# EAGLE schematic 63-00013_Battery_PCB_6.3 (EAGLE 9.6.2), part 1 of 2
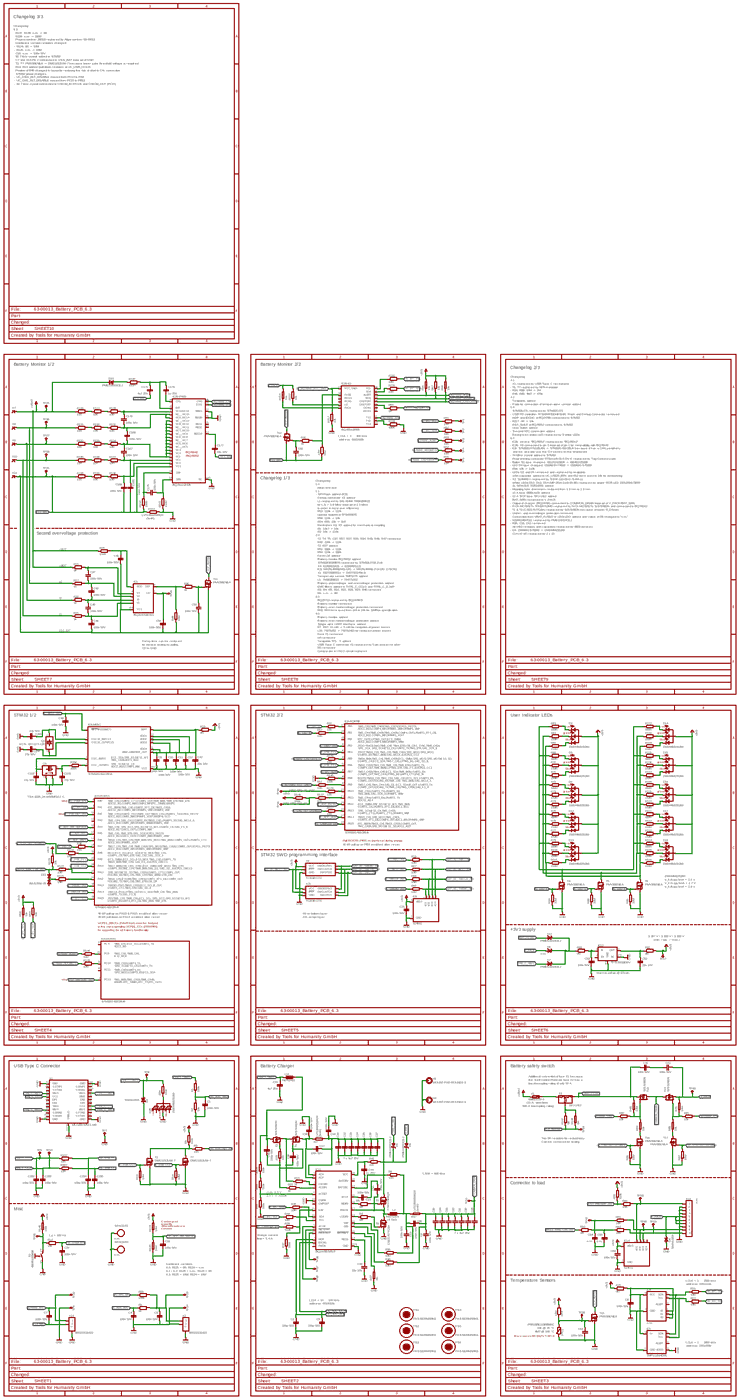
[diagram p0: schematic, sheet 1, overview]
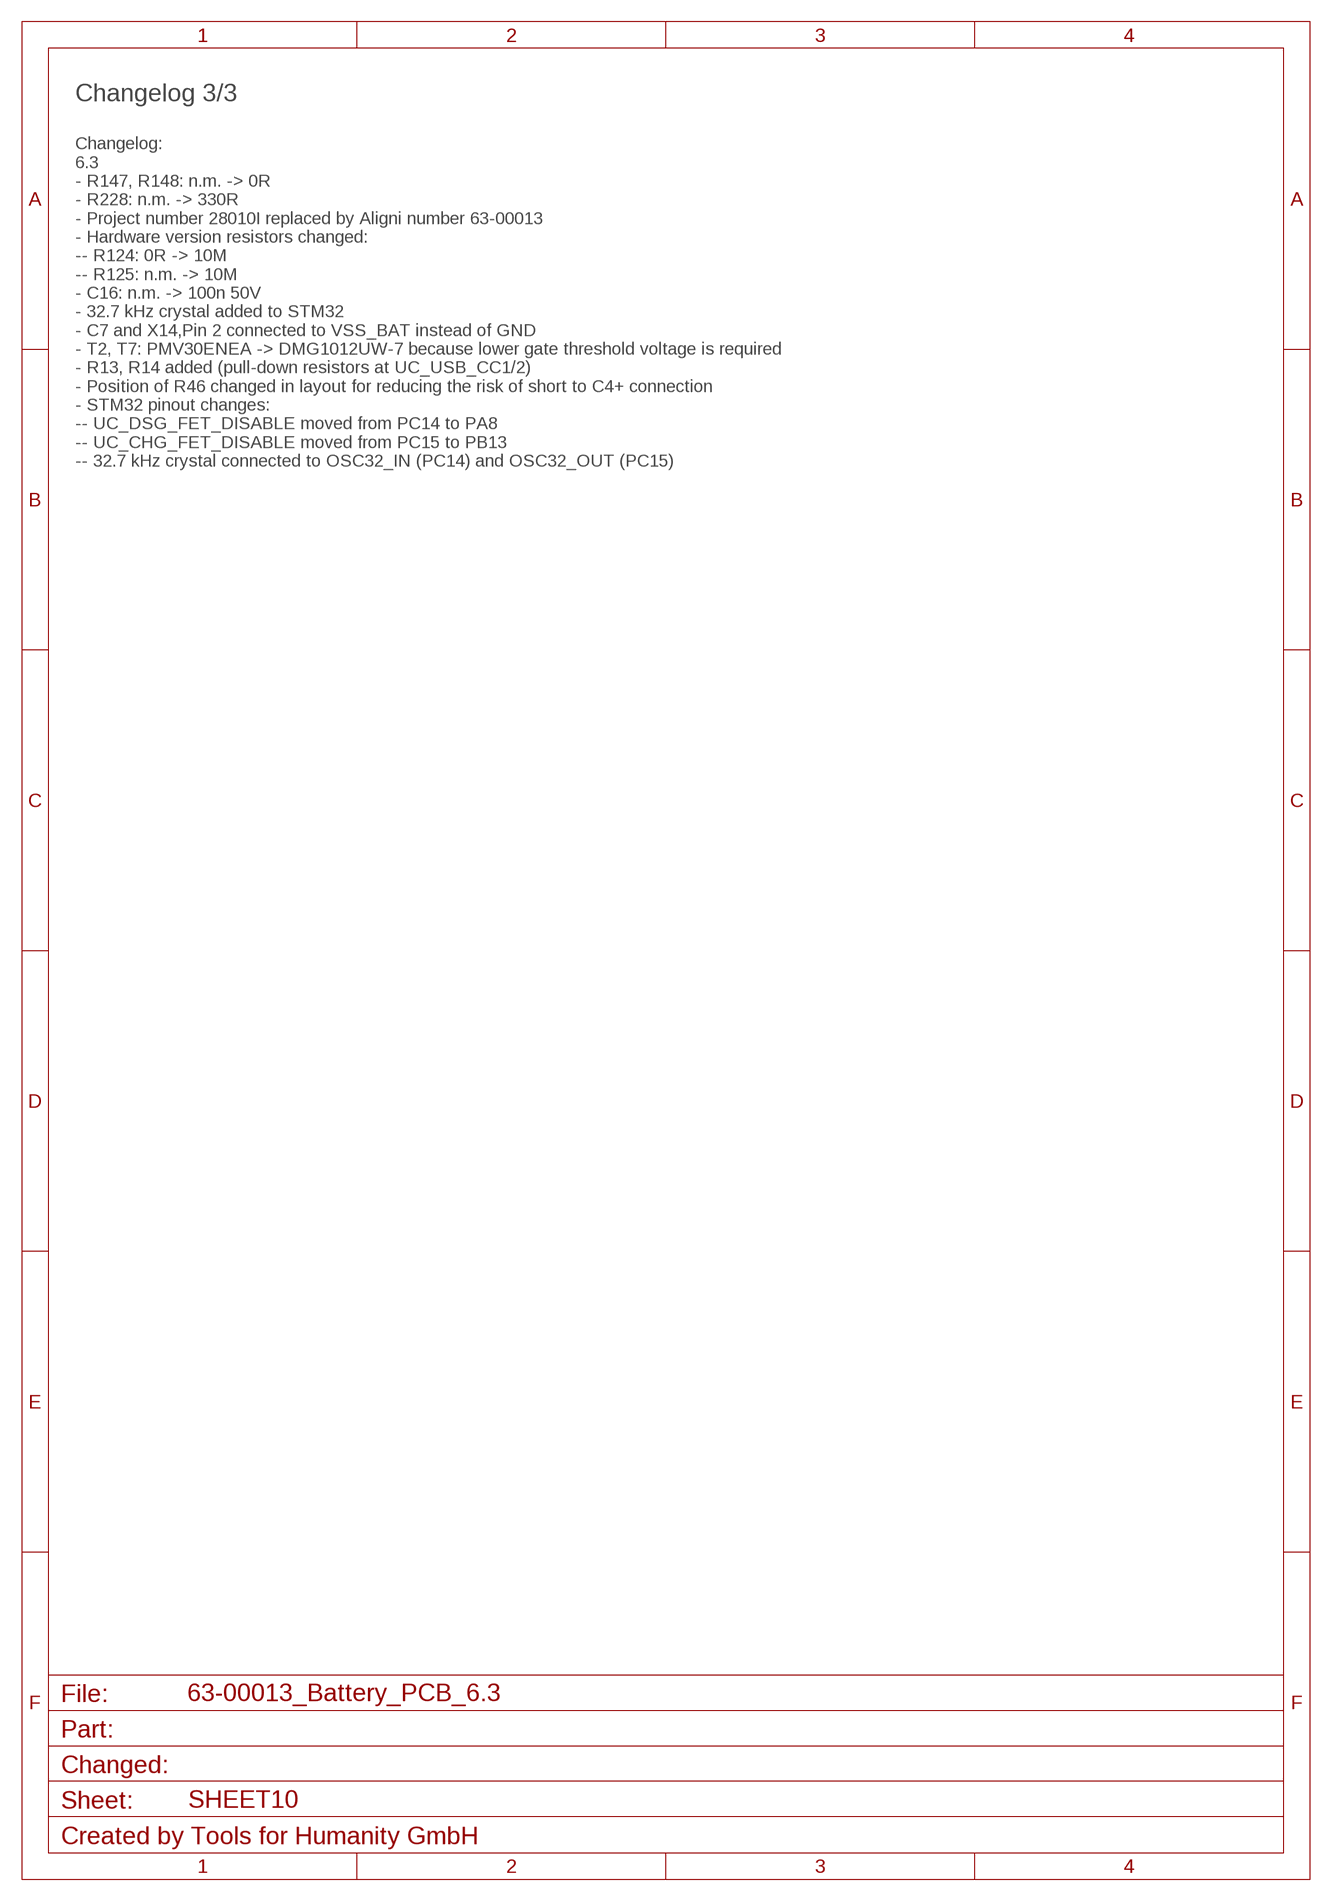
[diagram p1: schematic, sheet 1, part 1 of 7]
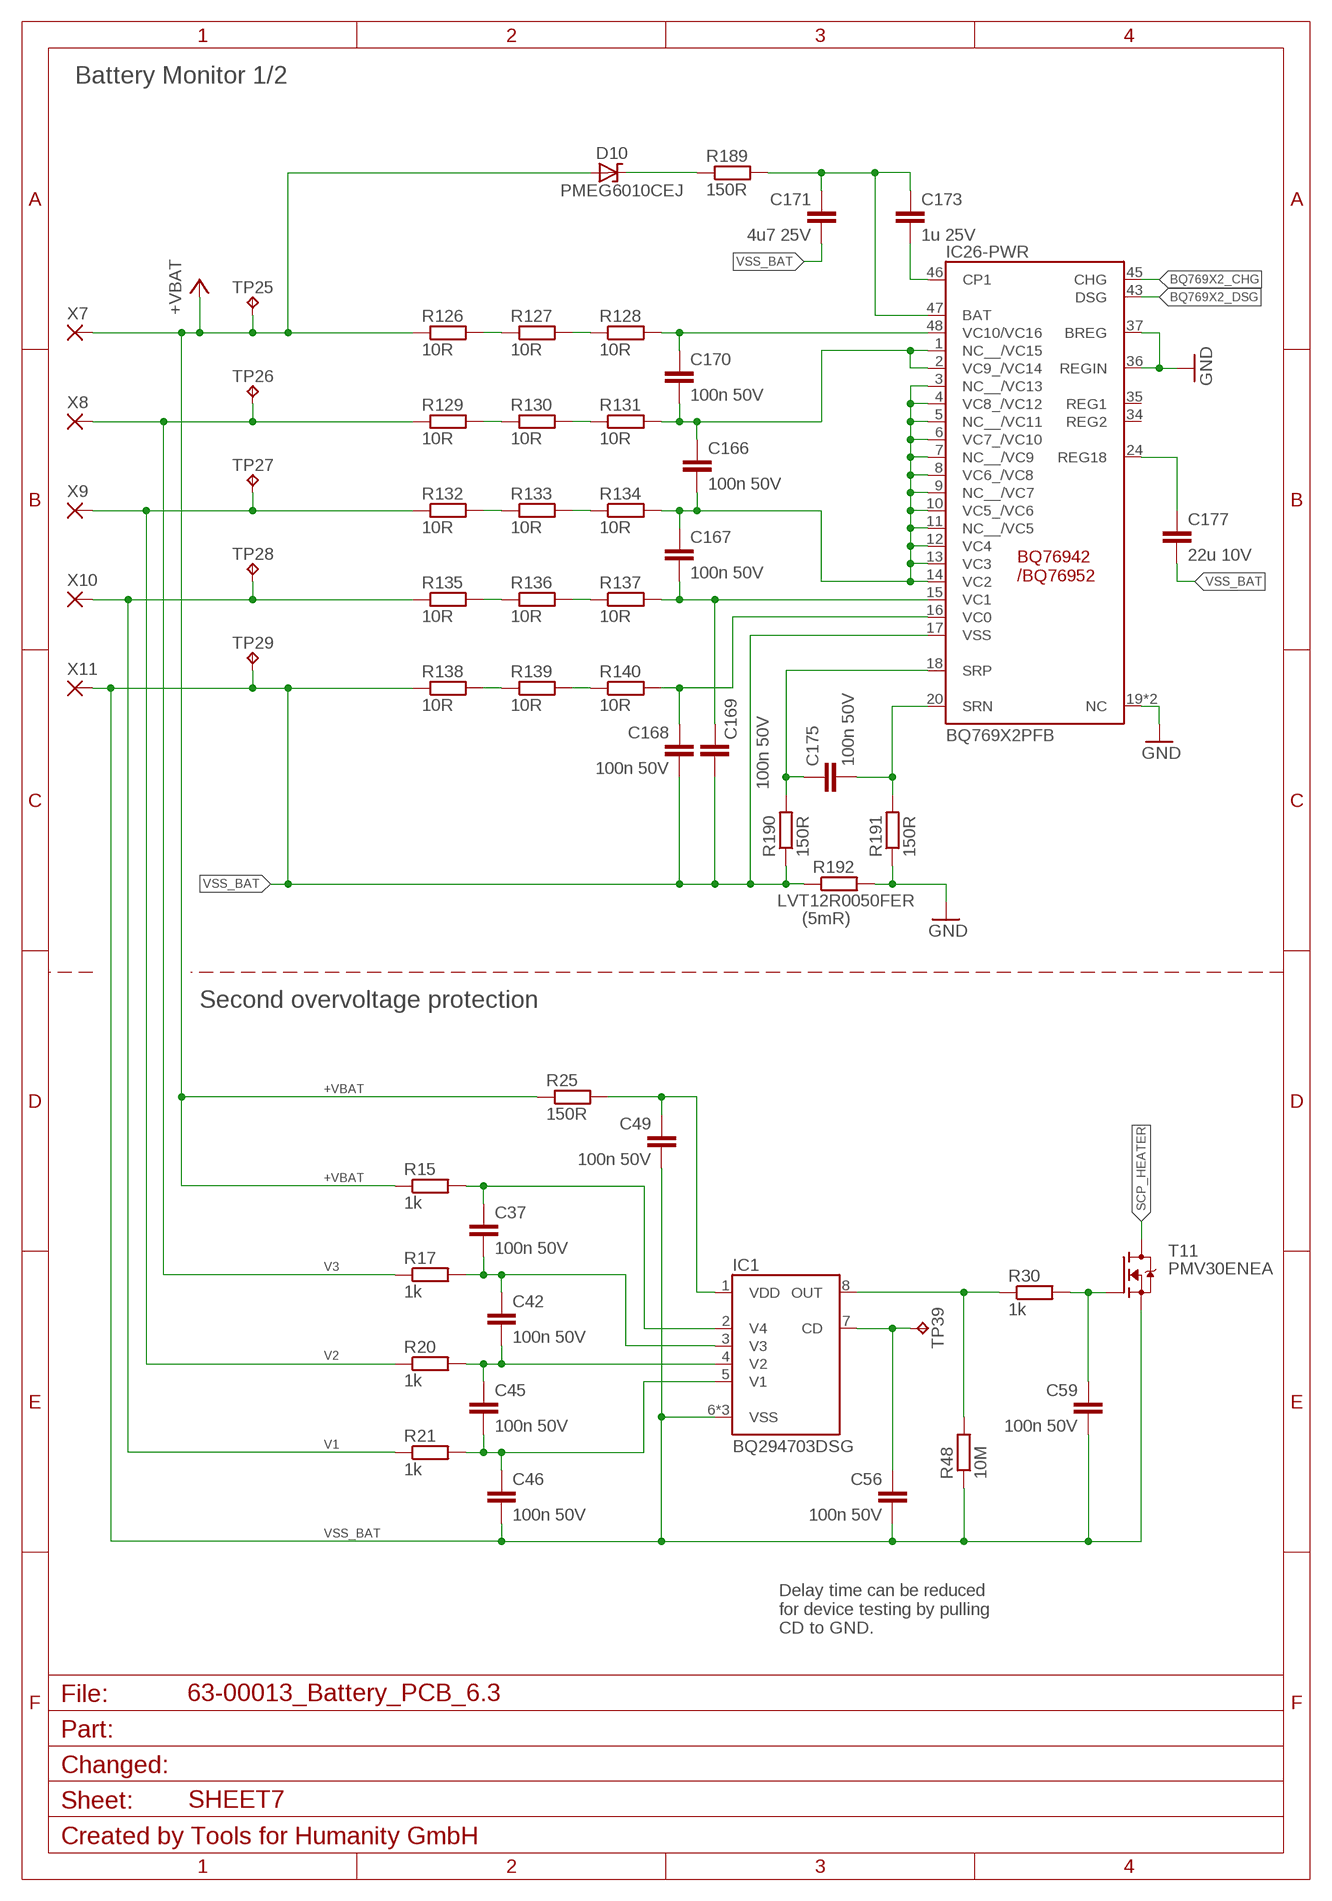
[diagram p2: schematic, sheet 1, part 2 of 7]
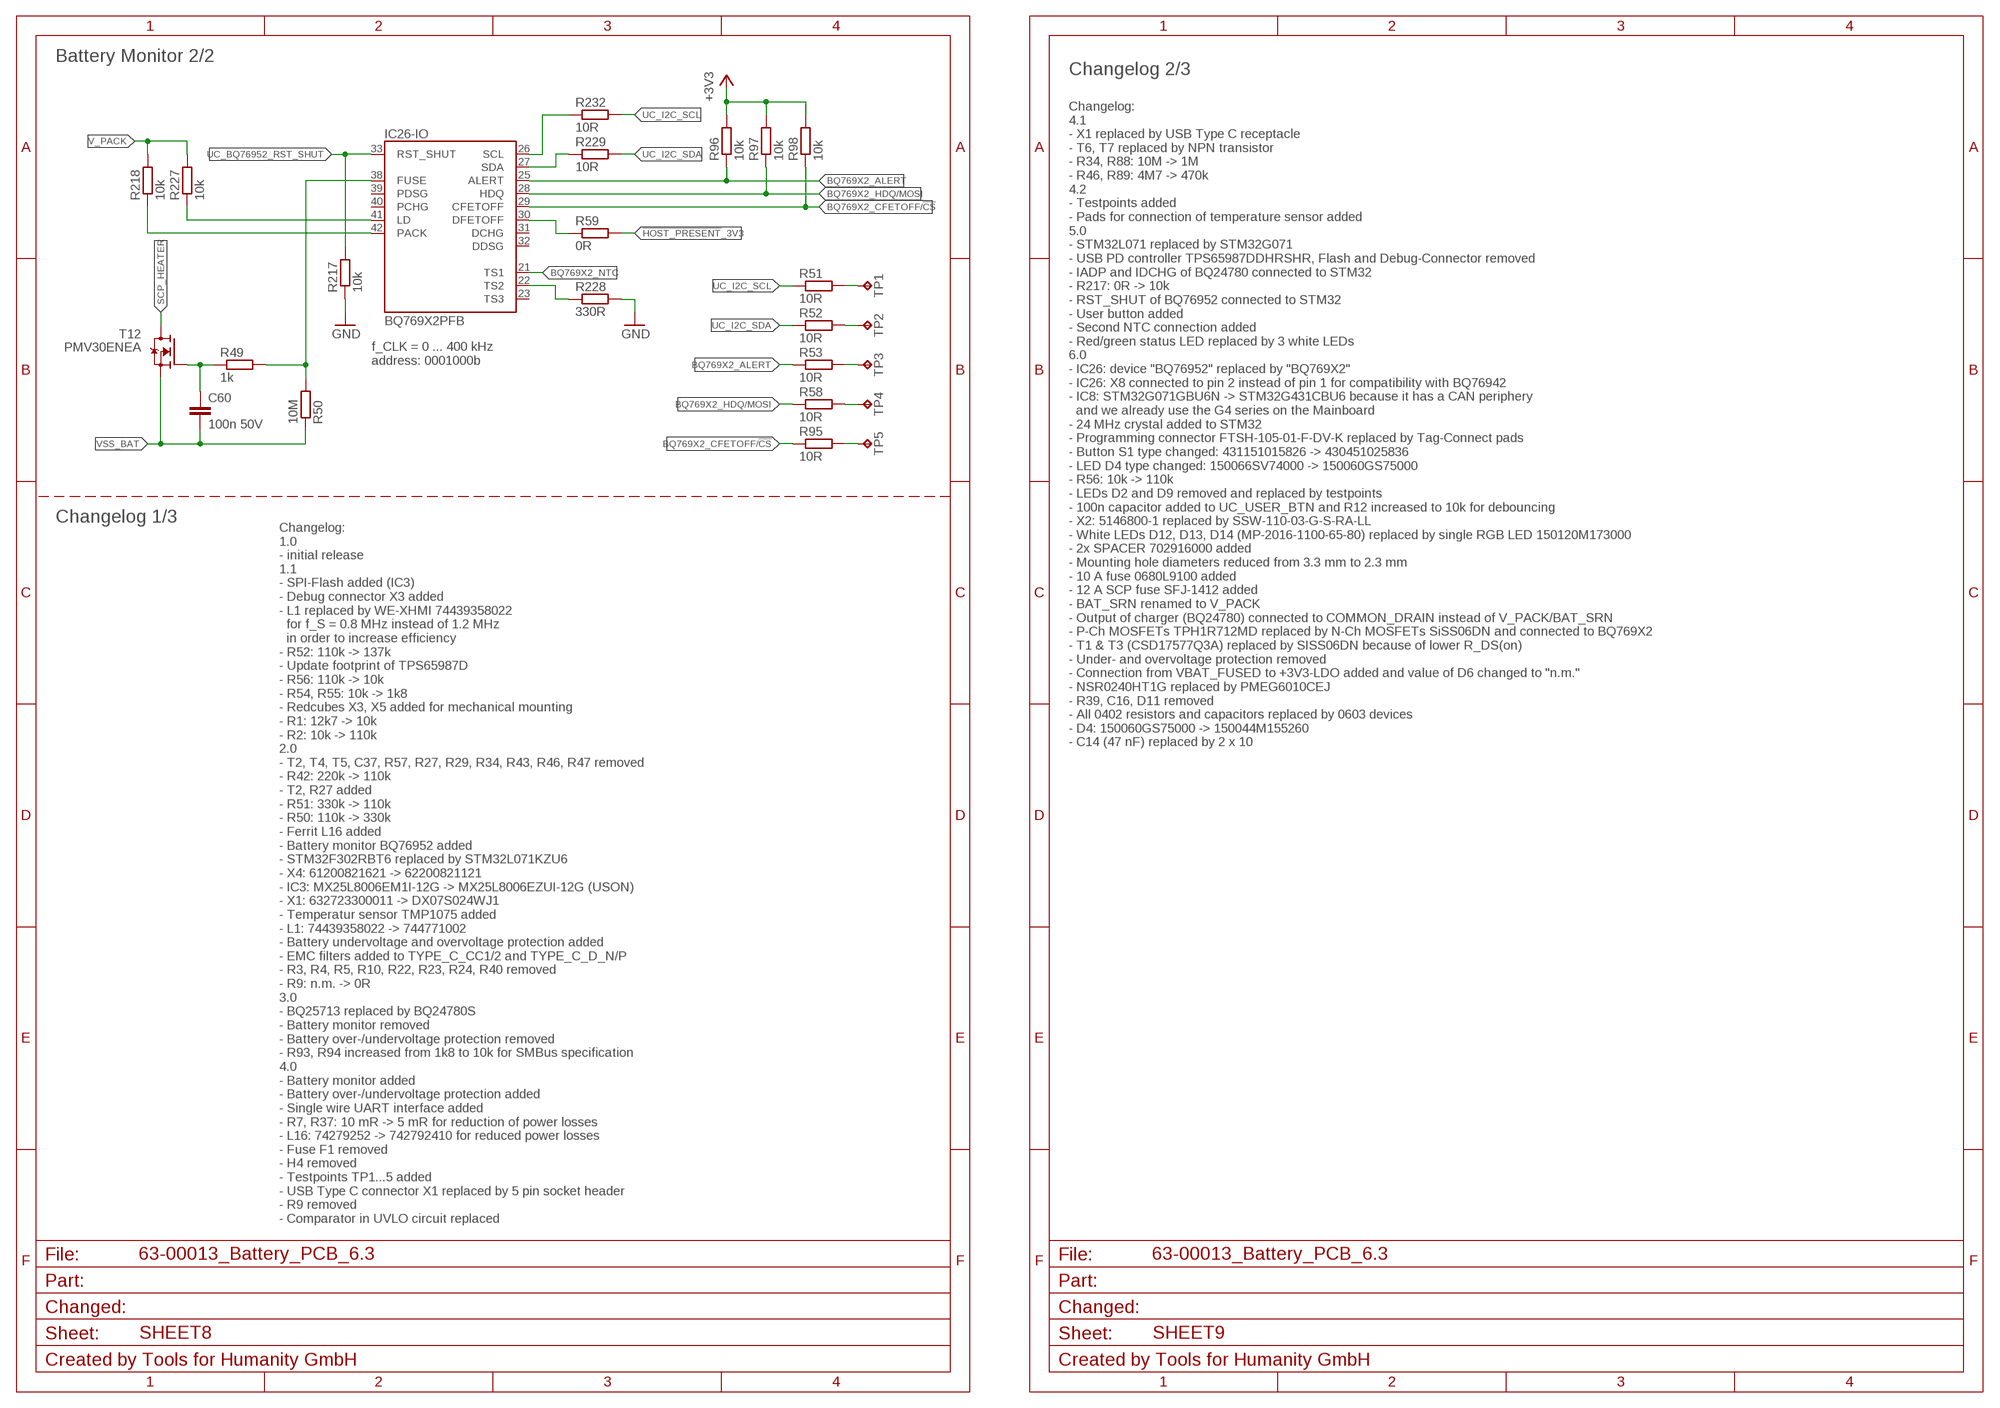
[diagram p3: schematic, sheet 1, part 3 of 7]
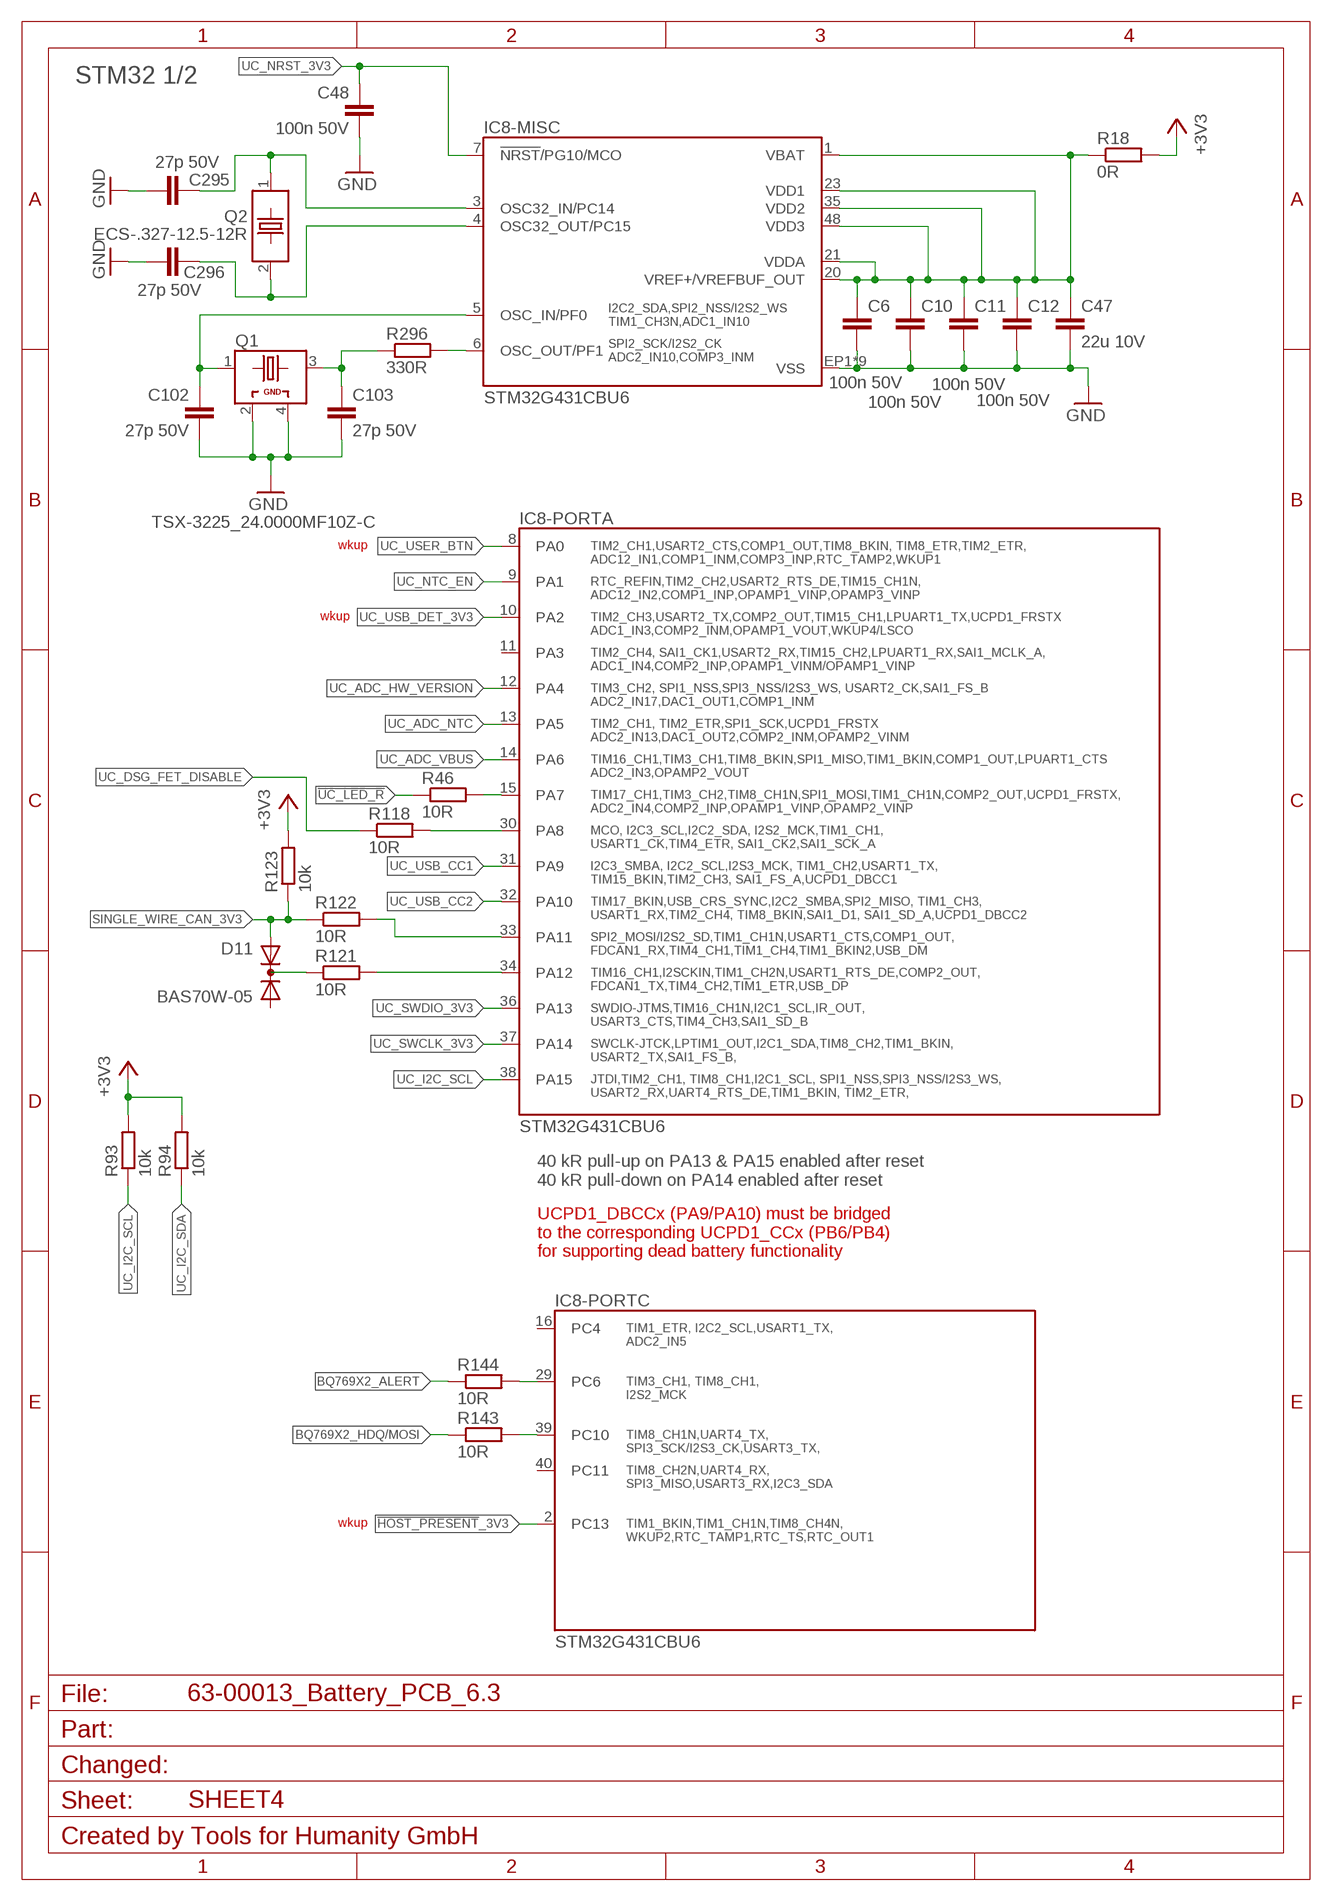
[diagram p4: schematic, sheet 1, part 4 of 7]
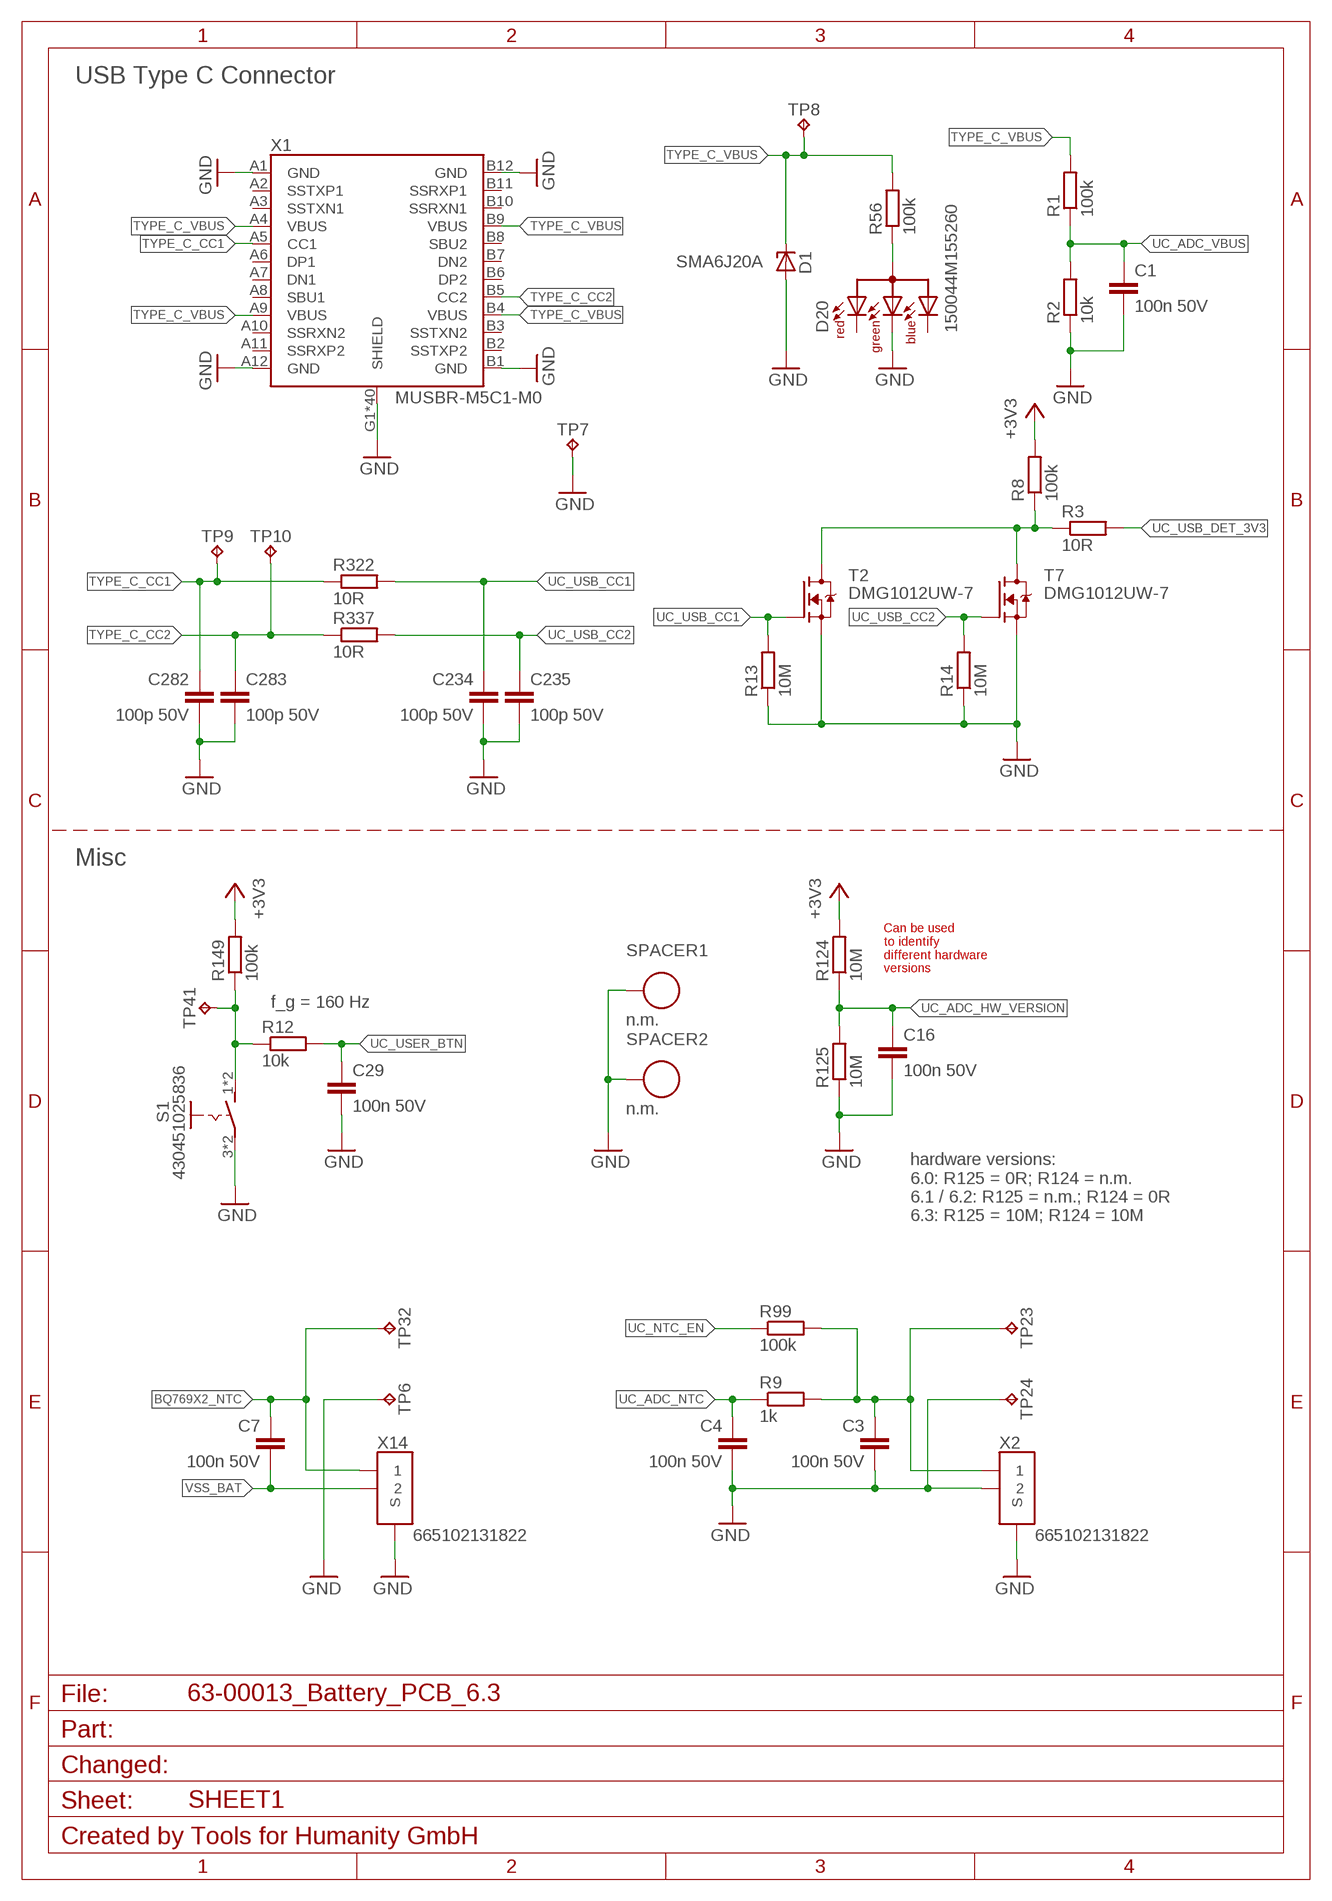
[diagram p5: schematic, sheet 1, part 5 of 7]
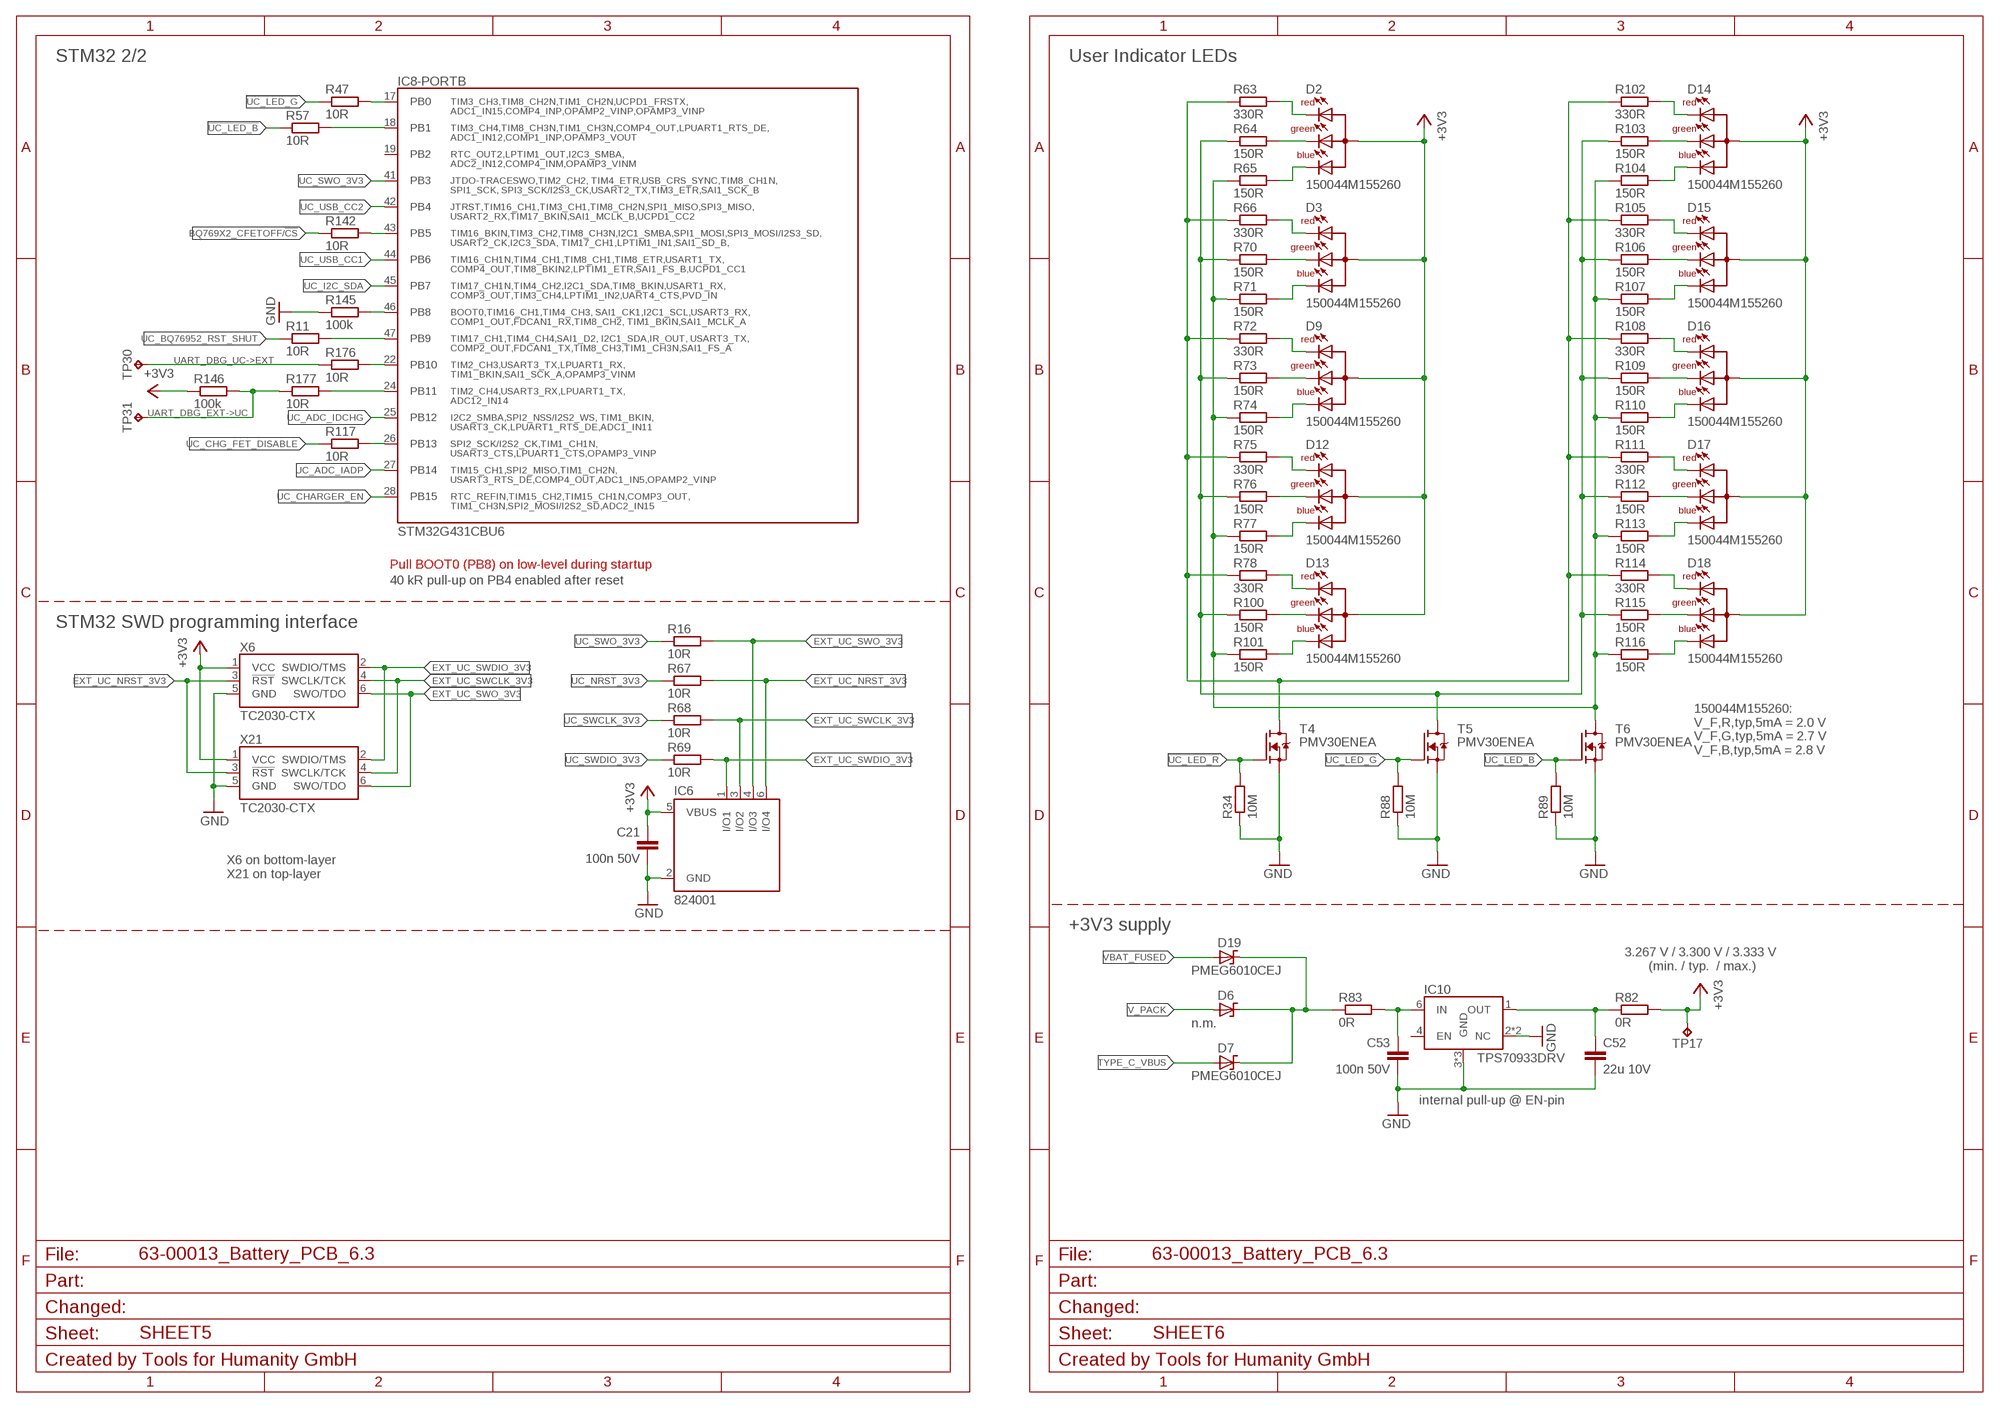
[diagram p6: schematic, sheet 1, part 6 of 7]
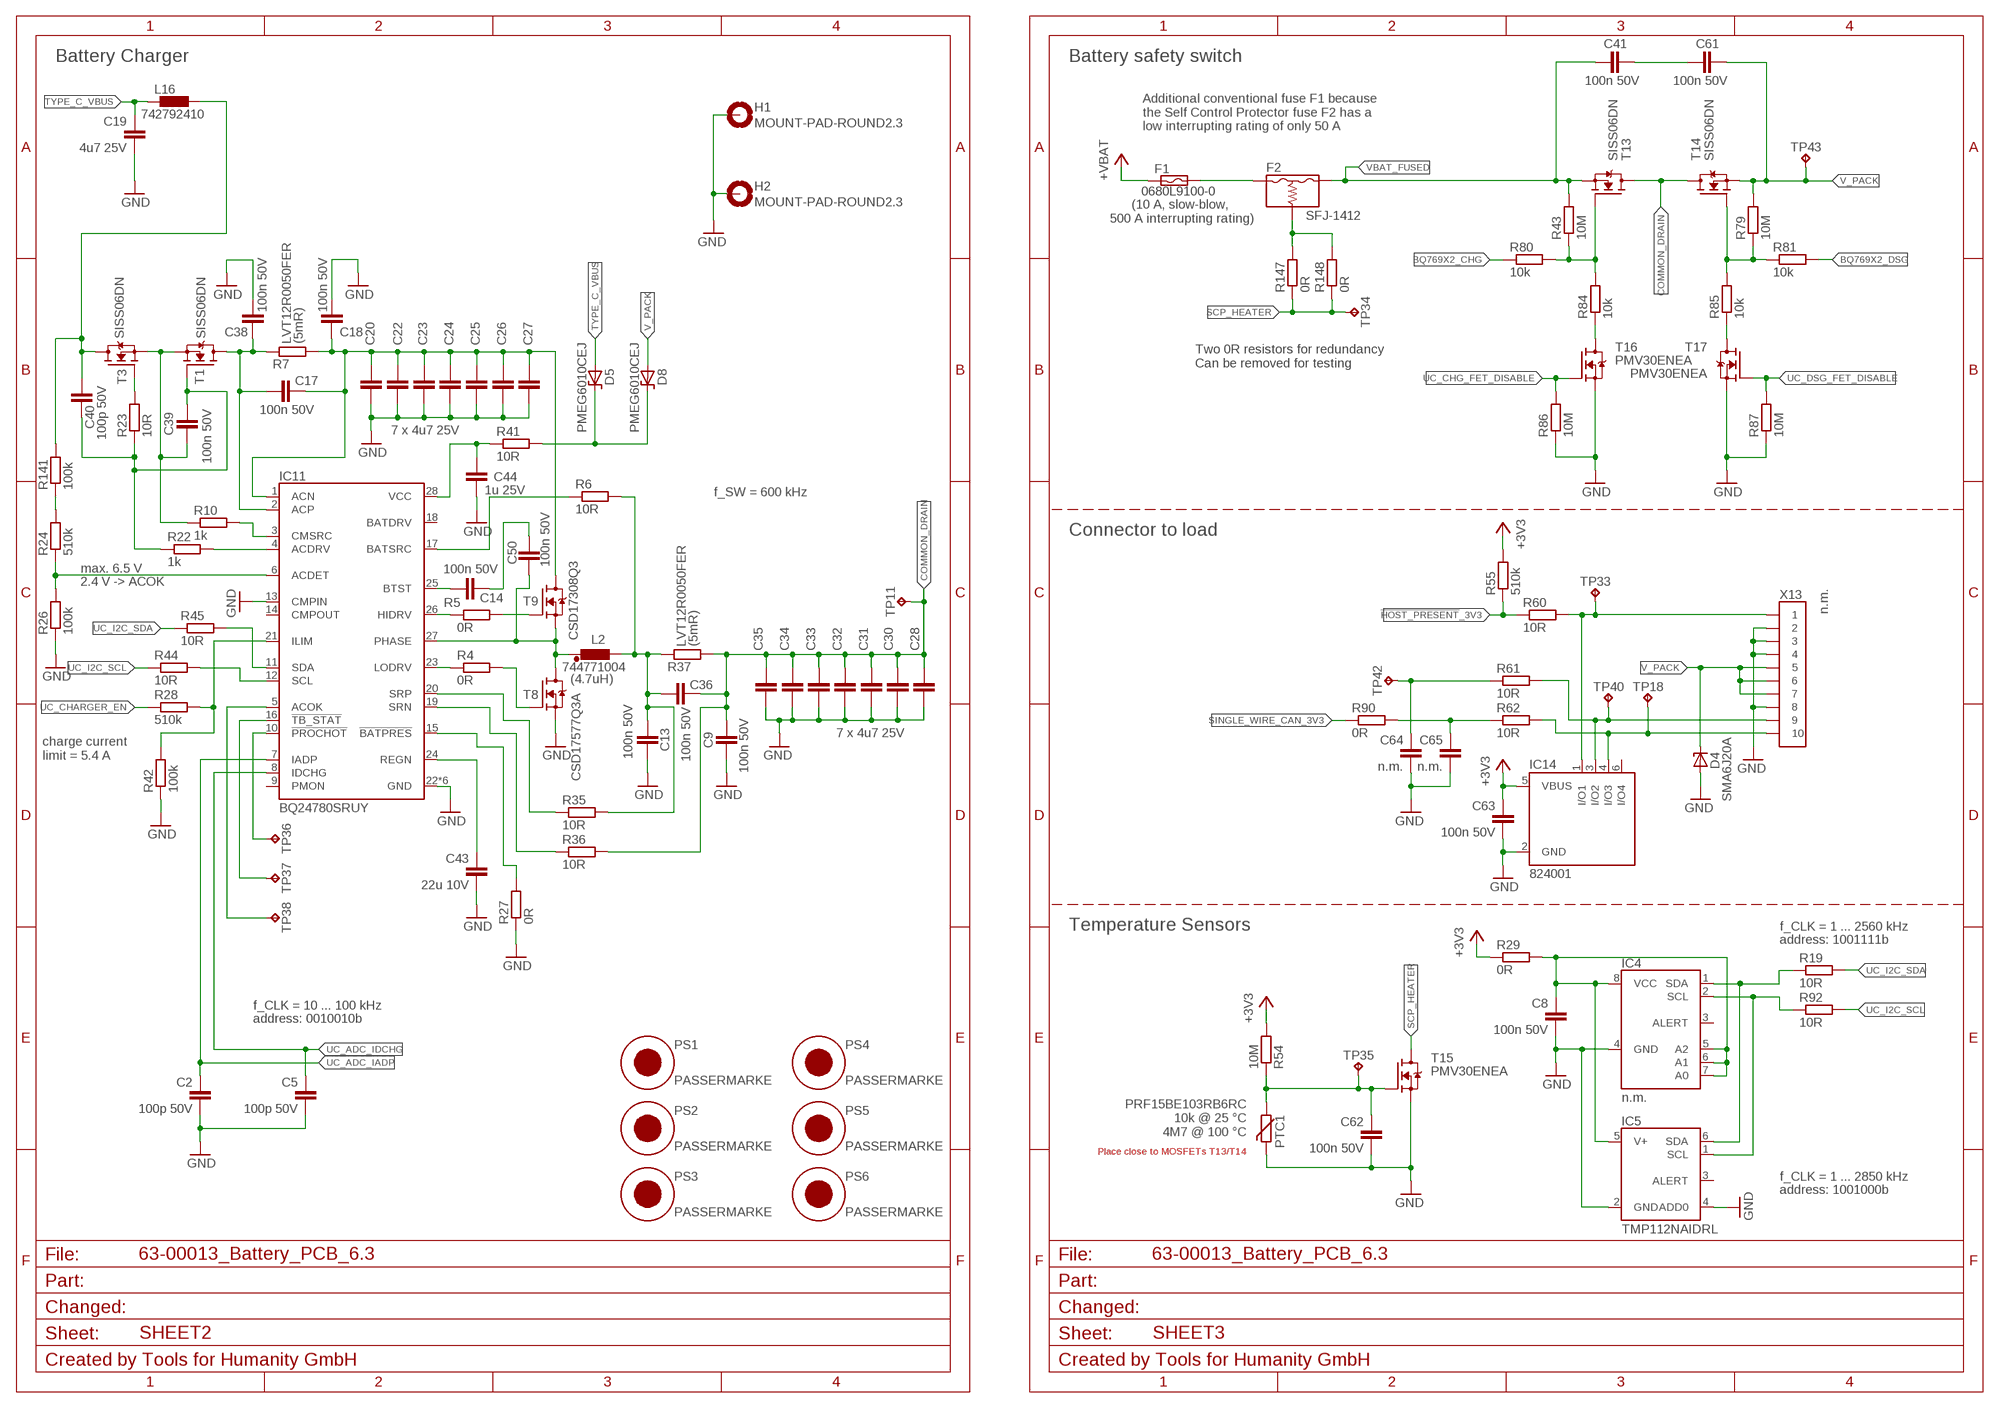
[diagram p7: schematic, sheet 1, part 7 of 7]

## Parts
C1  100n 50V  C-EU-100N-C0603  [C0603]
C2  100p 50V  C-EU-100P-C0603  [C0603]
C3  100n 50V  C-EU-100N-C0603  [C0603]
C4  100n 50V  C-EU-100N-C0603  [C0603]
C5  100p 50V  C-EU-100P-C0603  [C0603]
C6  100n 50V  C-EU-100N-C0603  [C0603]
C7  100n 50V  C-EU-100N-C0603  [C0603]
C8  100n 50V  C-EU-100N-C0603  [C0603]
C9  100n 50V  C-EU-100N-C0603  [C0603]
C10  100n 50V  C-EU-100N-C0603  [C0603]
C11  100n 50V  C-EU-100N-C0603  [C0603]
C12  100n 50V  C-EU-100N-C0603  [C0603]
C13  100n 50V  C-EU-100N-C0603  [C0603]
C14  100n 50V  C-EU-100N-C0603  [C0603]
C16  100n 50V  C-EU-100N-C0603  [C0603]
C17  100n 50V  C-EU-100N-C0603  [C0603]
C18  100n 50V  C-EU-100N-C0603  [C0603]
C19  4u7 25V  C-EU-4U7-25V-C1210  [C1210]
C20  4u7 25V  C-EU-4U7-25V-C1210  [C1210]
C21  100n 50V  C-EU-100N-C0603  [C0603]
C22  4u7 25V  C-EU-4U7-25V-C1210  [C1210]
C23  4u7 25V  C-EU-4U7-25V-C1210  [C1210]
C24  4u7 25V  C-EU-4U7-25V-C1210  [C1210]
C25  4u7 25V  C-EU-4U7-25V-C1210  [C1210]
C26  4u7 25V  C-EU-4U7-25V-C1210  [C1210]
C27  4u7 25V  C-EU-4U7-25V-C1210  [C1210]
C28  4u7 25V  C-EU-4U7-25V-C1210  [C1210]
C29  100n 50V  C-EU-100N-C0603  [C0603]
C30  4u7 25V  C-EU-4U7-25V-C1210  [C1210]
C31  4u7 25V  C-EU-4U7-25V-C1210  [C1210]
C32  4u7 25V  C-EU-4U7-25V-C1210  [C1210]
C33  4u7 25V  C-EU-4U7-25V-C1210  [C1210]
C34  4u7 25V  C-EU-4U7-25V-C1210  [C1210]
C35  4u7 25V  C-EU-4U7-25V-C1210  [C1210]
C36  100n 50V  C-EU-100N-C0603  [C0603]
C37  100n 50V  C-EU-100N-C0603  [C0603]
C38  100n 50V  C-EU-100N-C0603  [C0603]
C39  100n 50V  C-EU-100N-C0603  [C0603]
C40  100p 50V  C-EU-100P-C0603  [C0603]
C41  100n 50V  C-EU-100N-C0603  [C0603]
C42  100n 50V  C-EU-100N-C0603  [C0603]
C43  22u 10V  C-EU-22U-C0805  [C0805]
C44  1u 25V  C-EU-1U-C0805  [C0805]
C45  100n 50V  C-EU-100N-C0603  [C0603]
C46  100n 50V  C-EU-100N-C0603  [C0603]
C47  22u 10V  C-EU-22U-C0805  [C0805]
C48  100n 50V  C-EU-100N-C0603  [C0603]
C49  100n 50V  C-EU-100N-C0603  [C0603]
C50  100n 50V  C-EU-100N-C0603  [C0603]
C52  22u 10V  C-EU-22U-C0805  [C0805]
C53  100n 50V  C-EU-100N-C0603  [C0603]
C56  100n 50V  C-EU-100N-C0603  [C0603]
C59  100n 50V  C-EU-100N-C0603  [C0603]
C60  100n 50V  C-EU-100N-C0603  [C0603]
C61  100n 50V  C-EU-100N-C0603  [C0603]
C62  100n 50V  C-EU-100N-C0603  [C0603]
C63  100n 50V  C-EU-100N-C0603  [C0603]
C64  n.m.  C-EU-C0603  [C0603]
C65  n.m.  C-EU-C0603  [C0603]
C102  27p 50V  C-EU-27P-C0603  [C0603]
C103  27p 50V  C-EU-27P-C0603  [C0603]
C166  100n 50V  C-EU-100N-C0603  [C0603]
C167  100n 50V  C-EU-100N-C0603  [C0603]
C168  100n 50V  C-EU-100N-C0603  [C0603]
C169  100n 50V  C-EU-100N-C0603  [C0603]
C170  100n 50V  C-EU-100N-C0603  [C0603]
C171  4u7 25V  C-EU-4U7-25V-C1210  [C1210]
C173  1u 25V  C-EU-1U-C0805  [C0805]
C175  100n 50V  C-EU-100N-C0603  [C0603]
C177  22u 10V  C-EU-22U-C0805  [C0805]
C234  100p 50V  C-EU-100P-C0603  [C0603]
C235  100p 50V  C-EU-100P-C0603  [C0603]
C282  100p 50V  C-EU-100P-C0603  [C0603]
C283  100p 50V  C-EU-100P-C0603  [C0603]
C295  27p 50V  C-EU-27P-C0603  [C0603]
C296  27p 50V  C-EU-27P-C0603  [C0603]
D1  SMA6J20A  [SMA_ST]
D2  150044M155260  [150044M155260_WUERTH]
D3  150044M155260  [150044M155260_WUERTH]
D4  SMA6J20A  [SMA_ST]
D5  PMEG6010CEJ  [SOD323F_SC-90_NXP]
D6  n.m.  PMEG6010CEJ  [SOD323F_SC-90_NXP]
D7  PMEG6010CEJ  [SOD323F_SC-90_NXP]
D8  PMEG6010CEJ  [SOD323F_SC-90_NXP]
D9  150044M155260  [150044M155260_WUERTH]
D10  PMEG6010CEJ  [SOD323F_SC-90_NXP]
D11  BAS70W-05  [SOT-323_DIODES_INC]
D12  150044M155260  [150044M155260_WUERTH]
D13  150044M155260  [150044M155260_WUERTH]
D14  150044M155260  [150044M155260_WUERTH]
D15  150044M155260  [150044M155260_WUERTH]
D16  150044M155260  [150044M155260_WUERTH]
D17  150044M155260  [150044M155260_WUERTH]
D18  150044M155260  [150044M155260_WUERTH]
D19  PMEG6010CEJ  [SOD323F_SC-90_NXP]
D20  150044M155260  [150044M155260_WUERTH]
F1  0680L9100-0  [0680L_BEL_FUSE]
F2  SFJ-1412  [SFJ-XX12_DEXERIALS]
H1  MOUNT-PAD-ROUND2.3  [2,3-PAD]
H2  MOUNT-PAD-ROUND2.3  [2,3-PAD]
IC1  BQ294703DSG  [DSG0008A_WSON_TI]
IC4  n.m.  TMP1075DGK  [S-PDSO-G8_DGK_VSSOP_TI]
IC5  TMP112NAIDRL  [DRL0006A_TI]
IC6  824001  [SOT23-6L_WE]
IC8  STM32G431CBU6  [UFQFPN48_ST]
IC10  TPS70933DRV  [DRV0006A_TI]
IC11  BQ24780SRUY  [RUY0028A_TI]
IC14  824001  [SOT23-6L_WE]
IC26  BQ769X2PFB  [S-PQFP-G48_PFB_TI]
L2  744771004  [WE-PD_1260_WE]
L16  742792410  [FERRIT_1806_WUERTH]
PS1  PASSERMARKE  [PASSERMARKE]
PS2  PASSERMARKE  [PASSERMARKE]
PS3  PASSERMARKE  [PASSERMARKE]
PS4  PASSERMARKE  [PASSERMARKE]
PS5  PASSERMARKE  [PASSERMARKE]
PS6  PASSERMARKE  [PASSERMARKE]
PTC1  PRF15BE103RB6RC  [R0402]
Q1  TSX-3225_24.0000MF10Z-C  [TSX-3225_SEIKO_EPSON]
Q2  ECS-.327-12.5-12R  [ECX-12R_ECS]
R1  100k  R-EU-100K-R0603  [R0603]
R2  10k  R-EU-10K-R0603  [R0603]
R3  10R  R-EU-10R-R0603  [R0603]
R4  0R  R-EU-0R-R0603  [R0603]
R5  0R  R-EU-0R-R0603  [R0603]
R6  10R  R-EU-10R-R0603  [R0603]
R7  LVT12R0050FER  [LVT12_R003_OHMITE]
R8  100k  R-EU-100K-R0603  [R0603]
R9  1k  R-EU-1K-R0603  [R0603]
R10  1k  R-EU-1K-R0603  [R0603]
R11  10R  R-EU-10R-R0603  [R0603]
R12  10k  R-EU-10K-R0603  [R0603]
R13  10M  R-EU-10M-R0603  [R0603]
R14  10M  R-EU-10M-R0603  [R0603]
R15  1k  R-EU-1K-R0603  [R0603]
R16  10R  R-EU-10R-R0603  [R0603]
R17  1k  R-EU-1K-R0603  [R0603]
R18  0R  R-EU-0R-R0603  [R0603]
R19  10R  R-EU-10R-R0603  [R0603]
R20  1k  R-EU-1K-R0603  [R0603]
R21  1k  R-EU-1K-R0603  [R0603]
R22  1k  R-EU-1K-R0603  [R0603]
R23  10R  R-EU-10R-R0603  [R0603]
R24  510k  R-EU-510K-R0603  [R0603]
R25  150R  R-EU-150R-R0603  [R0603]
R26  100k  R-EU-100K-R0603  [R0603]
R27  0R  R-EU-0R-R0603  [R0603]
R28  510k  R-EU-510K-R0603  [R0603]
R29  0R  R-EU-0R-R0603  [R0603]
R30  1k  R-EU-1K-R0603  [R0603]
R34  10M  R-EU-10M-R0603  [R0603]
R35  10R  R-EU-10R-R0603  [R0603]
R36  10R  R-EU-10R-R0603  [R0603]
R37  LVT12R0050FER  [LVT12_R003_OHMITE]
R41  10R  R-EU-10R-R0603  [R0603]
R42  100k  R-EU-100K-R0603  [R0603]
R43  10M  R-EU-10M-R0603  [R0603]
R44  10R  R-EU-10R-R0603  [R0603]
R45  10R  R-EU-10R-R0603  [R0603]
R46  10R  R-EU-10R-R0603  [R0603]
R47  10R  R-EU-10R-R0603  [R0603]
R48  10M  R-EU-10M-R0603  [R0603]
R49  1k  R-EU-1K-R0603  [R0603]
R50  10M  R-EU-10M-R0603  [R0603]
R51  10R  R-EU-10R-R0603  [R0603]
R52  10R  R-EU-10R-R0603  [R0603]
R53  10R  R-EU-10R-R0603  [R0603]
R54  10M  R-EU-10M-R0603  [R0603]
R55  510k  R-EU-510K-R0603  [R0603]
R56  100k  R-EU-100K-R0603  [R0603]
R57  10R  R-EU-10R-R0603  [R0603]
R58  10R  R-EU-10R-R0603  [R0603]
R59  0R  R-EU-0R-R0603  [R0603]
R60  10R  R-EU-10R-R0603  [R0603]
R61  10R  R-EU-10R-R0603  [R0603]
R62  10R  R-EU-10R-R0603  [R0603]
R63  330R  R-EU-330R-R0603  [R0603]
R64  150R  R-EU-150R-R0603  [R0603]
R65  150R  R-EU-150R-R0603  [R0603]
R66  330R  R-EU-330R-R0603  [R0603]
R67  10R  R-EU-10R-R0603  [R0603]
R68  10R  R-EU-10R-R0603  [R0603]
R69  10R  R-EU-10R-R0603  [R0603]
R70  150R  R-EU-150R-R0603  [R0603]
R71  150R  R-EU-150R-R0603  [R0603]
R72  330R  R-EU-330R-R0603  [R0603]
R73  150R  R-EU-150R-R0603  [R0603]
R74  150R  R-EU-150R-R0603  [R0603]
R75  330R  R-EU-330R-R0603  [R0603]
R76  150R  R-EU-150R-R0603  [R0603]
R77  150R  R-EU-150R-R0603  [R0603]
R78  330R  R-EU-330R-R0603  [R0603]
R79  10M  R-EU-10M-R0603  [R0603]
R80  10k  R-EU-10K-R0603  [R0603]
R81  10k  R-EU-10K-R0603  [R0603]
R82  0R  R-EU-0R-R0603  [R0603]
R83  0R  R-EU-0R-R0603  [R0603]
R84  10k  R-EU-10K-R0603  [R0603]
R85  10k  R-EU-10K-R0603  [R0603]
R86  10M  R-EU-10M-R0603  [R0603]
R87  10M  R-EU-10M-R0603  [R0603]
R88  10M  R-EU-10M-R0603  [R0603]
R89  10M  R-EU-10M-R0603  [R0603]
R90  0R  R-EU-0R-R0603  [R0603]
R92  10R  R-EU-10R-R0603  [R0603]
R93  10k  R-EU-10K-R0603  [R0603]
R94  10k  R-EU-10K-R0603  [R0603]
R95  10R  R-EU-10R-R0603  [R0603]
R96  10k  R-EU-10K-R0603  [R0603]
R97  10k  R-EU-10K-R0603  [R0603]
R98  10k  R-EU-10K-R0603  [R0603]
R99  100k  R-EU-100K-R0603  [R0603]
R100  150R  R-EU-150R-R0603  [R0603]
R101  150R  R-EU-150R-R0603  [R0603]
R102  330R  R-EU-330R-R0603  [R0603]
R103  150R  R-EU-150R-R0603  [R0603]
R104  150R  R-EU-150R-R0603  [R0603]
R105  330R  R-EU-330R-R0603  [R0603]
R106  150R  R-EU-150R-R0603  [R0603]
R107  150R  R-EU-150R-R0603  [R0603]
R108  330R  R-EU-330R-R0603  [R0603]
R109  150R  R-EU-150R-R0603  [R0603]
R110  150R  R-EU-150R-R0603  [R0603]
R111  330R  R-EU-330R-R0603  [R0603]
R112  150R  R-EU-150R-R0603  [R0603]
R113  150R  R-EU-150R-R0603  [R0603]
R114  330R  R-EU-330R-R0603  [R0603]
R115  150R  R-EU-150R-R0603  [R0603]
R116  150R  R-EU-150R-R0603  [R0603]
R117  10R  R-EU-10R-R0603  [R0603]
R118  10R  R-EU-10R-R0603  [R0603]
R121  10R  R-EU-10R-R0603  [R0603]
R122  10R  R-EU-10R-R0603  [R0603]
R123  10k  R-EU-10K-R0603  [R0603]
R124  10M  R-EU-10M-R0603  [R0603]
R125  10M  R-EU-10M-R0603  [R0603]
R126  10R  R-EU-10R-R0603  [R0603]
R127  10R  R-EU-10R-R0603  [R0603]
R128  10R  R-EU-10R-R0603  [R0603]
R129  10R  R-EU-10R-R0603  [R0603]
R130  10R  R-EU-10R-R0603  [R0603]
R131  10R  R-EU-10R-R0603  [R0603]
R132  10R  R-EU-10R-R0603  [R0603]
R133  10R  R-EU-10R-R0603  [R0603]
R134  10R  R-EU-10R-R0603  [R0603]
R135  10R  R-EU-10R-R0603  [R0603]
R136  10R  R-EU-10R-R0603  [R0603]
R137  10R  R-EU-10R-R0603  [R0603]
R138  10R  R-EU-10R-R0603  [R0603]
R139  10R  R-EU-10R-R0603  [R0603]
R140  10R  R-EU-10R-R0603  [R0603]
R141  100k  R-EU-100K-R0603  [R0603]
R142  10R  R-EU-10R-R0603  [R0603]
R143  10R  R-EU-10R-R0603  [R0603]
R144  10R  R-EU-10R-R0603  [R0603]
R145  100k  R-EU-100K-R0603  [R0603]
R146  100k  R-EU-100K-R0603  [R0603]
R147  0R  R-EU-0R-R0603  [R0603]
R148  0R  R-EU-0R-R0603  [R0603]
R149  100k  R-EU-100K-R0603  [R0603]
R176  10R  R-EU-10R-R0603  [R0603]
R177  10R  R-EU-10R-R0603  [R0603]
R189  150R  R-EU-150R-R0603  [R0603]
R190  150R  R-EU-150R-R0603  [R0603]
R191  150R  R-EU-150R-R0603  [R0603]
R192  LVT12R0050FER  [LVT12_R003_OHMITE]
R217  10k  R-EU-10K-R0603  [R0603]
R218  10k  R-EU-10K-R0603  [R0603]
R227  10k  R-EU-10K-R0603  [R0603]
R228  330R  R-EU-330R-R0603  [R0603]
R229  10R  R-EU-10R-R0603  [R0603]
R232  10R  R-EU-10R-R0603  [R0603]
R296  330R  R-EU-330R-R0603  [R0603]
R322  10R  R-EU-10R-R0603  [R0603]
R337  10R  R-EU-10R-R0603  [R0603]
S1  430451025836  [430451025836_WUERTH]
SPACER1  n.m.  702916000  [702916000_WUERTH]
SPACER2  n.m.  702916000  [702916000_WUERTH]
T1  SISS06DN  [POWERPAK_1212-8S_VISHAY]
T2  DMG1012UW-7  [SOT-323_DIODES_INC]
T3  SISS06DN  [POWERPAK_1212-8S_VISHAY]
T4  PMV30ENEA  [SOT-23_NXP]
T5  PMV30ENEA  [SOT-23_NXP]
T6  PMV30ENEA  [SOT-23_NXP]
T7  DMG1012UW-7  [SOT-323_DIODES_INC]
T8  CSD17577Q3A  [Q3A_TI]
T9  CSD17308Q3  [Q3_TI]
T11  PMV30ENEA  [SOT-23_NXP]
T12  PMV30ENEA  [SOT-23_NXP]
T13  SISS06DN  [POWERPAK_1212-8S_VISHAY]
T14  SISS06DN  [POWERPAK_1212-8S_VISHAY]
T15  PMV30ENEA  [SOT-23_NXP]
T16  PMV30ENEA  [SOT-23_NXP]
T17  PMV30ENEA  [SOT-23_NXP]
TP1  TESTPOINT_VIA_ROUND_0.8MM  [TESTVIA_ROUND_0.8MM]
TP2  TESTPOINT_VIA_ROUND_0.8MM  [TESTVIA_ROUND_0.8MM]
TP3  TESTPOINT_VIA_ROUND_0.8MM  [TESTVIA_ROUND_0.8MM]
TP4  TESTPOINT_VIA_ROUND_0.8MM  [TESTVIA_ROUND_0.8MM]
TP5  TESTPOINT_VIA_ROUND_0.8MM  [TESTVIA_ROUND_0.8MM]
TP6  TESTPOINT_VIA_ROUND_0.8MM  [TESTVIA_ROUND_0.8MM]
TP7  TESTPOINT_VIA_ROUND_0.8MM  [TESTVIA_ROUND_0.8MM]
TP8  TESTPOINT_VIA_ROUND_0.8MM  [TESTVIA_ROUND_0.8MM]
TP9  TESTPOINT_VIA_ROUND_0.8MM  [TESTVIA_ROUND_0.8MM]
TP10  TESTPOINT_VIA_ROUND_0.8MM  [TESTVIA_ROUND_0.8MM]
TP11  TESTPOINT_VIA_ROUND_0.8MM  [TESTVIA_ROUND_0.8MM]
TP17  TESTPOINT_VIA_ROUND_0.8MM  [TESTVIA_ROUND_0.8MM]
TP18  TESTPOINT_VIA_ROUND_0.8MM  [TESTVIA_ROUND_0.8MM]
TP23  TESTPOINT_VIA_ROUND_0.8MM  [TESTVIA_ROUND_0.8MM]
TP24  TESTPOINT_VIA_ROUND_0.8MM  [TESTVIA_ROUND_0.8MM]
TP25  TESTPOINT_VIA_ROUND_0.8MM  [TESTVIA_ROUND_0.8MM]
TP26  TESTPOINT_VIA_ROUND_0.8MM  [TESTVIA_ROUND_0.8MM]
TP27  TESTPOINT_VIA_ROUND_0.8MM  [TESTVIA_ROUND_0.8MM]
TP28  TESTPOINT_VIA_ROUND_0.8MM  [TESTVIA_ROUND_0.8MM]
TP29  TESTPOINT_VIA_ROUND_0.8MM  [TESTVIA_ROUND_0.8MM]
TP30  TESTPOINT_VIA_ROUND_0.8MM  [TESTVIA_ROUND_0.8MM]
TP31  TESTPOINT_VIA_ROUND_0.8MM  [TESTVIA_ROUND_0.8MM]
TP32  TESTPOINT_VIA_ROUND_0.8MM  [TESTVIA_ROUND_0.8MM]
TP33  TESTPOINT_VIA_ROUND_0.8MM  [TESTVIA_ROUND_0.8MM]
TP34  TESTPOINT_VIA_ROUND_0.8MM  [TESTVIA_ROUND_0.8MM]
TP35  TESTPOINT_VIA_ROUND_0.8MM  [TESTVIA_ROUND_0.8MM]
TP36  TESTPOINT_VIA_ROUND_0.8MM  [TESTVIA_ROUND_0.8MM]
TP37  TESTPOINT_VIA_ROUND_0.8MM  [TESTVIA_ROUND_0.8MM]
TP38  TESTPOINT_VIA_ROUND_0.8MM  [TESTVIA_ROUND_0.8MM]
TP39  TESTPOINT_VIA_ROUND_0.8MM  [TESTVIA_ROUND_0.8MM]
TP40  TESTPOINT_VIA_ROUND_0.8MM  [TESTVIA_ROUND_0.8MM]
TP41  TESTPOINT_VIA_ROUND_0.8MM  [TESTVIA_ROUND_0.8MM]
TP42  TESTPOINT_VIA_ROUND_0.8MM  [TESTVIA_ROUND_0.8MM]
TP43  TESTPOINT_VIA_ROUND_0.8MM  [TESTVIA_ROUND_0.8MM]
X1  MUSBR-M5C1-M0  [MUSBR-M5C1-XX_AMPHENOL]
X2  665102131822  [665102131822_WURTH]
X6  TC2030-CTX  [TC2030-IDC-FP_TAGCONNECT]
X7  WIREPAD_0.8X6.5MM  [WIREPAD_0.8X6.5MM]
X8  WIREPAD_0.8X6.5MM  [WIREPAD_0.8X6.5MM]
X9  WIREPAD_0.8X6.5MM  [WIREPAD_0.8X6.5MM]
X10  WIREPAD_0.8X6.5MM  [WIREPAD_0.8X6.5MM]
X11  WIREPAD_0.8X6.5MM  [WIREPAD_0.8X6.5MM]
X13  n.m.  SSW-110-03-G-S-RA-LL  [SSW-110-03-G-S-RA-LL_SAMTEC]
X14  665102131822  [665102131822_WURTH]
X21  TC2030-CTX  [TC2030-IDC-FP_TAGCONNECT]

## Nets
!HOST_PRESENT!_3V3: IC8.2(-PORTC:PC13) R55.1 R59.2 R60.1
!LED_B: R65.1 R71.1 R74.1 R77.1 R101.1 R104.1 R107.1 R110.1 R113.1 R116.1 T6.3(D)
!LED_G: R64.1 R70.1 R73.1 R76.1 R100.1 R103.1 R106.1 R109.1 R112.1 R115.1 T5.3(D)
!LED_R: R63.1 R66.1 R72.1 R75.1 R78.1 R102.1 R105.1 R108.1 R111.1 R114.1 T4.3(D)
!UC_LED_B: R57.1 R89.2 T6.1(G)
!UC_LED_G: R47.1 R88.2 T5.1(G)
!UC_LED_R: R34.2 R46.1 T4.1(G)
+3V3: C21.1 C63.1 D2.1(A) D3.1(A) D9.1(A) D12.1(A) D13.1(A) D14.1(A) D15.1(A) D16.1(A) D17.1(A) D18.1(A) IC6.5(VBUS) IC14.5(VBUS) R8.2 R18.2 R29.1 R54.2 R55.2 R82.2 R93.2 R94.2 R96.2 R97.2 R98.2 R123.2 R124.2 R146.1 R149.2 TP17.P$1(TP) X6.1(VCC) X21.1(VCC)
+VBAT: D10.A F1.1 R15.1 R25.1 R126.1 TP25.P$1(TP) X7.P$1(P) X7.P$2(P) X7.P$3(P) X7.P$4(P) X7.P$5(P) X7.P$6(P) X7.P$7(P) X7.P$8(P) X7.P$9(P) X7.P$10(P) X7.P$11(P) X7.P$12(P) X7.P$13(P) X7.P$14(P) X7.P$15(P) X7.P$16(P) X7.P$17(P) X7.P$18(P) X7.P$19(P) X7.P$20(P) X7.P$21(P) X7.P$22(P) X7.P$23(P) X7.P$24(P) X7.P$25(P) X7.P$26(P) X7.P$27(P) X7.P$28(P) X7.P$29(P) X7.P$30(P) X7.P$31(P) X7.P$32(P) X7.P$33(P) X7.P$34(P) X7.P$35(P) X7.P$36(P) X7.P$37(P) X7.P$38(P) X7.P$39(P) X7.P$40(P) X7.P$41(P) X7.P$42(P) X7.P$43(P) X7.P$44(P) X7.P$45(P) X7.P$46(P) X7.P$47(P) X7.P$48(P) X7.P$49(P) X7.P$50(P) X7.P$51(P) X7.P$52(P) X7.P$53(P) X7.P$54(P) X7.P$55(P) X7.P$56(P) X7.P$57(P) X7.P$58(P) X7.P$59(P) X7.P$60(P) X7.P$61(P) X7.P$62(P) X7.P$63(P) X7.P$64(P) X7.P$65(P) X7.P$66(P) X7.P$67(P)
BQ769X2_ALERT: IC26.25(-IO:ALERT) R53.1 R96.1 R144.1
BQ769X2_CFETOFF/!CS: IC26.29(-IO:CFETOFF) R95.1 R98.1 R142.1
BQ769X2_CHG: IC26.45(-PWR:CHG) R80.1
BQ769X2_DSG: IC26.43(-PWR:DSG) R81.2
BQ769X2_HDQ/MOSI: IC26.28(-IO:HDQ) R58.1 R97.1 R143.1
BQ769X2_NTC: C7.1 IC26.21(-IO:TS1) TP32.P$1(TP) X14.1
CHARGER_VCC: D6.C D7.C D19.C R83.1
COMMON_DRAIN: C9.1 C28.1 C30.1 C31.1 C32.1 C33.1 C34.1 C35.1 C36.2 R36.2 R37.2 T13.5(D) T14.5(D) TP11.P$1(TP)
EXT_UC_NRST_3V3: IC6.6(I/O4) R67.2 X6.3(!RST) X21.3(!RST)
EXT_UC_SWCLK_3V3: IC6.3(I/O2) R68.2 X6.4(SWCLK/TCK) X21.4(SWCLK/TCK)
EXT_UC_SWDIO_3V3: IC6.1(I/O1) R69.2 X6.2(SWDIO/TMS) X21.2(SWDIO/TMS)
EXT_UC_SWO_3V3: IC6.4(I/O3) R16.2 X6.6(SWO/TDO) X21.6(SWO/TDO)
GND: C1.2 C2.2 C3.2 C4.2 C5.2 C6.2 C8.2 C9.2 C10.2 C11.2 C12.2 C13.2 C16.2 C18.1 C19.2 C20.2 C21.2 C22.2 C23.2 C24.2 C25.2 C26.2 C27.2 C28.2 C29.2 C30.2 C31.2 C32.2 C33.2 C34.2 C35.2 C38.1 C43.2 C44.2 C47.2 C48.2 C52.2 C53.2 C62.2 C63.2 C64.2 C65.2 C102.2 C103.2 C234.2 C235.2 C282.2 C283.2 C295.2 C296.2 D1.A D4.A D20.3(C_GREEN) H1.B2,3(MOUNT) H2.B2,3(MOUNT) IC4.4(GND) IC5.2(GND) IC5.4(ADD0) IC6.2(GND) IC8.EP1(-MISC:VSS) IC8.EP2(-MISC:VSS) IC8.EP3(-MISC:VSS) IC8.EP4(-MISC:VSS) IC8.EP5(-MISC:VSS) IC8.EP6(-MISC:VSS) IC8.EP7(-MISC:VSS) IC8.EP8(-MISC:VSS) IC8.EP9(-MISC:VSS) IC10.2(NC) IC10.3(GND) IC10.5(NC) IC10.7.1(GND) IC10.7.2(GND) IC11.13(CMPIN) IC11.22(GND) IC11.E1(GND) IC11.E2(GND) IC11.E3(GND) IC11.E4(GND) IC11.E5(GND) IC14.2(GND) IC26.19(-PWR:NC) IC26.36(-PWR:REGIN) IC26.37(-PWR:BREG) IC26.44(-PWR:NC) PTC1.1 Q1.2(G1) Q1.4(G2) R2.1 R13.1 R14.1 R26.1 R27.1 R34.1 R42.1 R86.1 R87.1 R88.1 R89.1 R125.1 R145.1 R191.1 R192.2 R217.1 R228.2 S1.3(P) S1.4(P) SPACER1.P$1 SPACER2.P$1 T2.2(S) T4.2(S) T5.2(S) T6.2(S) T7.2(S) T8.1(S) T8.2(S) T8.3(S) T15.2(S) T16.2(S) T17.2(S) TP6.P$1(TP) TP7.P$1(TP) TP24.P$1(TP) X1.A1(GND) X1.A12(GND) X1.B1(GND) X1.B12(GND) X1.G1(SHIELD) X1.G2(SHIELD) X1.G3(SHIELD) X1.G4(SHIELD) X1.G5(SHIELD) X1.G6(SHIELD) X1.S1(SHIELD) X1.S2(SHIELD) X1.S3(SHIELD) X1.S4(SHIELD) X1.S5(SHIELD) X1.S6(SHIELD) X1.S7(SHIELD) X1.S8(SHIELD) X1.S9(SHIELD) X1.S10(SHIELD) X1.S11(SHIELD) X1.S12(SHIELD) X1.S13(SHIELD) X1.S14(SHIELD) X1.S15(SHIELD) X1.S16(SHIELD) X1.S17(SHIELD) X1.S18(SHIELD) X1.S19(SHIELD) X1.S20(SHIELD) X1.S21(SHIELD) X1.S22(SHIELD) X1.S23(SHIELD) X1.S24(SHIELD) X1.S25(SHIELD) X1.S26(SHIELD) X1.S27(SHIELD) X1.S28(SHIELD) X1.S29(SHIELD) X1.S30(SHIELD) X1.S31(SHIELD) X1.S32(SHIELD) X1.S33(SHIELD) X1.S34(SHIELD) X2.2 X2.S1(S) X2.S2(S) X6.5(GND) X13.2 X13.3 X13.4 X13.8 X14.S1(S) X14.S2(S) X21.5(GND)
N$1: C64.1 R61.1 TP42.P$1(TP)
N$2: D5.C D8.C R41.2
N$3: R12.1 R149.1 S1.1(S) S1.2(S) TP41.P$1(TP)
N$4: IC8.15(-PORTA:PA7) R46.2
N$5: IC8.47(-PORTB:PB9) R11.2
N$6: IC8.18(-PORTB:PB1) R57.2
N$7: D11.3(C) R121.1
N$8: C103.1 Q1.3(C2) R296.1
N$9: IC11.10(!PROCHOT) TP36.P$1(TP)
N$10: IC11.16(!TB_STAT) TP37.P$1(TP)
N$11: IC11.5(ACOK) TP38.P$1(TP)
N$12: C45.2 C46.1 IC1.5(V1) R21.2
N$13: C42.2 C45.1 IC1.4(V2) R20.2
N$14: C37.2 C42.1 IC1.3(V3) R17.2
N$15: C37.1 IC1.2(V4) R15.2
N$16: C49.1 IC1.1(VDD) R25.2
N$17: C56.1 IC1.7(CD) TP39.P$1(TP)
N$18: IC1.8(OUT) R30.1 R48.2
N$19: F1.2 F2.T1(F1)
N$20: C59.1 R30.2 T11.1(G)
N$21: C14.2 IC11.25(BTST)
N$22: C60.1 R49.1 T12.1(G)
N$23: IC4.2(SCL) IC5.1(SCL) R92.1
N$24: IC11.17(BATSRC) R6.1
N$25: C17.1 C38.2 IC11.2(ACP) R7.1 T1.5(D)
N$26: C13.1 C36.1 L2.NODOT R6.2 R35.2 R37.1
N$27: C17.2 C18.2 C20.1 C22.1 C23.1 C24.1 C25.1 C26.1 C27.1 IC11.1(ACN) R7.2 T9.5(D) T9.P$1(D) T9.P$4(D) T9.P$5(D) T9.P$6(D) T9.P$7(D)
N$28: IC11.4(ACDRV) R22.2
N$29: IC11.3(CMSRC) R10.2
N$30: C39.1 R10.1 T1.1(S) T1.2(S) T1.3(S) T3.1(S) T3.2(S) T3.3(S)
N$31: C39.2 C40.1 R22.1 R23.1 T1.4(G)
N$32: IC26.38(-IO:FUSE) R49.2 R50.2
N$33: C8.1 IC4.5(A2) IC4.6(A1) IC4.7(A0) IC4.8(VCC) IC5.5(V+) R29.2
N$34: C62.1 PTC1.2 R54.1 T15.1(G) TP35.P$1(TP)
N$35: IC26.30(-IO:DFETOFF) R59.1
N$36: C40.2 L16.1 R141.2 T3.5(D)
N$37: C41.1 C61.2
N$38: IC14.1(I/O1) R60.2 TP33.P$1(TP) X13.1
N$39: C6.1 C10.1 C11.1 C12.1 C47.1 IC8.1(-MISC:VBAT) IC8.20(-MISC:VREF+/VREFBUF_OUT) IC8.21(-MISC:VDDA) IC8.23(-MISC:VDD1) IC8.35(-MISC:VDD2) IC8.48(-MISC:VDD3) R18.1
N$40: IC11.19(SRN) R36.1
N$41: IC11.20(SRP) R35.1
N$42: R5.2 T9.4(G)
N$43: R23.2 T3.4(G)
N$44: IC11.12(SCL) R44.2
N$45: IC11.11(SDA) R45.2
N$46: IC11.6(ACDET) R24.1 R26.2
N$47: IC11.21(ILIM) R28.2 R42.2
N$48: IC14.3(I/O2) R61.2 TP40.P$1(TP) X13.9
N$49: IC14.4(I/O3) R62.2 TP18.P$1(TP) X13.10
N$50: IC11.15(!BATPRES) R27.2
N$51: C50.2 IC11.27(PHASE) L2.DOT T8.5(D) T8.P$1(D) T8.P$2(D) T8.P$3(D) T8.P$4(D) T8.P$5(D) T8.P$6(D) T8.P$7(D) T9.1(S) T9.2(S) T9.3(S)
N$52: IC8.34(-PORTA:PA12) R121.2
N$53: C44.1 IC11.28(VCC) R41.1
N$54: C65.1 R62.1 R90.2
N$55: C43.1 IC11.24(REGN)
N$56: C168.1 IC26.16(-PWR:VC0) R140.2
N$57: C177.1 IC26.24(-PWR:REG18)
N$58: IC8.22(-PORTB:PB10) R176.2
N$59: IC8.24(-PORTB:PB11) R177.2
N$60: IC8.33(-PORTA:PA11) R122.2
N$61: D2.3(C_GREEN) R64.2
N$62: D2.2(C_RED) R63.2
N$63: D20.1(A) R56.1
N$64: R127.2 R128.1
N$65: R43.1 R80.2 R84.2 T13.4(G)
N$66: D2.4(C_BLUE) R65.2
N$67: D3.3(C_GREEN) R70.2
N$68: D3.2(C_RED) R66.2
N$69: D3.4(C_BLUE) R71.2
N$70: D9.3(C_GREEN) R73.2
N$71: D9.2(C_RED) R72.2
N$72: D9.4(C_BLUE) R74.2
N$73: R79.1 R81.1 R85.2 T14.4(G)
N$74: C52.1 IC10.1(OUT) R82.1
N$75: C53.1 IC10.6(IN) R83.2
N$76: R85.1 T17.3(D)
N$77: R84.1 T16.3(D)
N$78: C14.1 C50.1
N$79: R126.2 R127.1
N$80: IC4.1(SDA) IC5.6(SDA) R19.1
N$81: R130.2 R131.1
N$82: IC11.26(HIDRV) R5.1
N$83: IC11.23(LODRV) R4.1
N$84: R4.2 T8.4(G)
N$85: R95.2 TP5.P$1(TP)
N$86: R58.2 TP4.P$1(TP)
N$87: R53.2 TP3.P$1(TP)
N$88: R52.2 TP2.P$1(TP)
N$89: R51.2 TP1.P$1(TP)
N$90: C3.1 R9.2 R99.2 TP23.P$1(TP) X2.1
N$91: D12.3(C_GREEN) R76.2
N$92: R129.2 R130.1
N$93: D12.2(C_RED) R75.2
N$94: D12.4(C_BLUE) R77.2
N$95: D13.3(C_GREEN) R100.2
N$96: D13.2(C_RED) R78.2
N$97: D13.4(C_BLUE) R101.2
N$98: D14.3(C_GREEN) R103.2
N$99: D14.2(C_RED) R102.2
N$100: D14.4(C_BLUE) R104.2
N$101: D15.3(C_GREEN) R106.2
N$102: D15.2(C_RED) R105.2
N$103: D15.4(C_BLUE) R107.2
N$104: D16.3(C_GREEN) R109.2
N$105: D16.2(C_RED) R108.2
N$106: D16.4(C_BLUE) R110.2
N$107: D17.3(C_GREEN) R112.2
N$108: D17.2(C_RED) R111.2
N$109: D17.4(C_BLUE) R113.2
N$110: D18.3(C_GREEN) R115.2
N$111: D18.2(C_RED) R114.2
N$112: D18.4(C_BLUE) R116.2
N$113: R133.2 R134.1
N$114: R132.2 R133.1
N$115: R136.2 R137.1
N$116: R135.2 R136.1
N$117: R139.2 R140.1
N$118: R138.2 R139.1
N$119: R24.2 R141.1
N$120: IC8.46(-PORTB:PB8) R145.2
N$121: F2.T2(H) R147.2 R148.2
N$122: R3.1 R8.1 T2.3(D) T7.3(D)
N$123: IC8.30(-PORTA:PA8) R118.2
N$124: IC8.26(-PORTB:PB13) R117.2
N$126: IC8.17(-PORTB:PB0) R47.2
N$128: IC8.43(-PORTB:PB5) R142.2
N$129: IC8.39(-PORTC:PC10) R143.2
N$130: IC8.29(-PORTC:PC6) R144.2
N$232: C166.2 C167.1 IC26.3(-PWR:NC__/VC13) IC26.4(-PWR:VC8_/VC12) IC26.5(-PWR:NC__/VC11) IC26.6(-PWR:VC7_/VC10) IC26.7(-PWR:NC__/VC9) IC26.8(-PWR:VC6_/VC8) IC26.9(-PWR:NC__/VC7) IC26.10(-PWR:VC5_/VC6) IC26.11(-PWR:NC__/VC5) IC26.12(-PWR:VC4) IC26.13(-PWR:VC3) IC26.14(-PWR:VC2) R134.2
N$233: C166.1 C170.2 IC26.1(-PWR:NC__/VC15) IC26.2(-PWR:VC9_/VC14) R131.2
N$234: C167.2 C169.1 IC26.15(-PWR:VC1) R137.2
N$241: C170.1 IC26.48(-PWR:VC10/VC16) R128.2
N$244: C102.1 IC8.5(-MISC:OSC_IN/PF0) Q1.1(C1)
N$245: C173.2 IC26.46(-PWR:CP1)
N$246: D10.C R189.1
N$247: C171.1 C173.1 IC26.47(-PWR:BAT) R189.2
N$248: C175.1 IC26.18(-PWR:SRP) R190.2
N$249: C175.2 IC26.20(-PWR:SRN) R191.2
N$259: IC8.6(-MISC:OSC_OUT/PF1) R296.2
N$271: IC26.27(-IO:SDA) R229.1
N$272: IC26.26(-IO:SCL) R232.1
N$273: IC26.41(-IO:LD) R227.1
N$274: IC26.42(-IO:PACK) R218.1
N$275: IC26.22(-IO:TS2) R228.1
N$470: C296.1 IC8.4(-MISC:OSC32_OUT/PC15) Q2.2
N$471: C295.1 IC8.3(-MISC:OSC32_IN/PC14) Q2.1
SCP_HEATER: R147.1 R148.1 T11.3(D) T12.3(D) T15.3(D) TP34.P$1(TP)
SINGLE_WIRE_CAN_3V3: D11.2(A2) R90.1 R122.1 R123.1
TYPE_C_CC1: C282.1 R322.1 TP9.P$1(TP) X1.A5(CC1)
TYPE_C_CC2: C283.1 R337.1 TP10.P$1(TP) X1.B5(CC2)
TYPE_C_VBUS: C19.1 D1.C D5.A D7.A L16.2 R1.2 R56.2 TP8.P$1(TP) X1.A4(VBUS) X1.A9(VBUS) X1.B4(VBUS) X1.B9(VBUS)
UART_DBG_EXT->UC: R146.2 R177.1 TP31.P$1(TP)
UART_DBG_UC->EXT: R176.1 TP30.P$1(TP)
UC_ADC_HW_VERSION: C16.1 IC8.12(-PORTA:PA4) R124.1 R125.2
UC_ADC_IADP: C2.1 IC8.27(-PORTB:PB14) IC11.7(IADP)
UC_ADC_IDCHG: C5.1 IC8.25(-PORTB:PB12) IC11.8(IDCHG)
UC_ADC_NTC: C4.1 IC8.13(-PORTA:PA5) R9.1
UC_ADC_VBUS: C1.1 IC8.14(-PORTA:PA6) R1.1 R2.2
UC_BQ76952_RST_SHUT: IC26.33(-IO:RST_SHUT) R11.1 R217.2
UC_CHARGER_EN: IC8.28(-PORTB:PB15) R28.1
UC_CHG_FET_DISABLE: R86.2 R117.1 T16.1(G)
UC_DSG_FET_DISABLE: R87.2 R118.1 T17.1(G)
UC_I2C_SCL: IC8.38(-PORTA:PA15) R44.1 R51.1 R92.2 R93.1 R232.2
UC_I2C_SDA: IC8.45(-PORTB:PB7) R19.2 R45.1 R52.1 R94.1 R229.2
UC_NRST_3V3: C48.1 IC8.7(-MISC:!NRST!/PG10/MCO) R67.1
UC_NTC_EN: IC8.9(-PORTA:PA1) R99.1
UC_SWCLK_3V3: IC8.37(-PORTA:PA14) R68.1
UC_SWDIO_3V3: IC8.36(-PORTA:PA13) R69.1
UC_SWO_3V3: IC8.41(-PORTB:PB3) R16.1
UC_USB_CC1: C234.1 IC8.31(-PORTA:PA9) IC8.44(-PORTB:PB6) R13.2 R322.2 T2.1(G)
UC_USB_CC2: C235.1 IC8.32(-PORTA:PA10) IC8.42(-PORTB:PB4) R14.2 R337.2 T7.1(G)
UC_USB_DET_3V3: IC8.10(-PORTA:PA2) R3.2
UC_USER_BTN: C29.1 IC8.8(-PORTA:PA0) R12.2
V1: R21.1 R135.1 TP28.P$1(TP) X10.P$1(P) X10.P$2(P) X10.P$3(P) X10.P$4(P) X10.P$5(P) X10.P$6(P) X10.P$7(P) X10.P$8(P) X10.P$9(P) X10.P$10(P) X10.P$11(P) X10.P$12(P) X10.P$13(P) X10.P$14(P) X10.P$15(P) X10.P$16(P) X10.P$17(P) X10.P$18(P) X10.P$19(P) X10.P$20(P) X10.P$21(P) X10.P$22(P) X10.P$23(P) X10.P$24(P) X10.P$25(P) X10.P$26(P) X10.P$27(P) X10.P$28(P) X10.P$29(P) X10.P$30(P) X10.P$31(P) X10.P$32(P) X10.P$33(P) X10.P$34(P) X10.P$35(P) X10.P$36(P) X10.P$37(P) X10.P$38(P) X10.P$39(P) X10.P$40(P) X10.P$41(P) X10.P$42(P) X10.P$43(P) X10.P$44(P) X10.P$45(P) X10.P$46(P) X10.P$47(P) X10.P$48(P) X10.P$49(P) X10.P$50(P) X10.P$51(P) X10.P$52(P) X10.P$53(P) X10.P$54(P) X10.P$55(P) X10.P$56(P) X10.P$57(P) X10.P$58(P) X10.P$59(P) X10.P$60(P) X10.P$61(P) X10.P$62(P) X10.P$63(P) X10.P$64(P) X10.P$65(P) X10.P$66(P) X10.P$67(P)
V2: R20.1 R132.1 TP27.P$1(TP) X9.P$1(P) X9.P$2(P) X9.P$3(P) X9.P$4(P) X9.P$5(P) X9.P$6(P) X9.P$7(P) X9.P$8(P) X9.P$9(P) X9.P$10(P) X9.P$11(P) X9.P$12(P) X9.P$13(P) X9.P$14(P) X9.P$15(P) X9.P$16(P) X9.P$17(P) X9.P$18(P) X9.P$19(P) X9.P$20(P) X9.P$21(P) X9.P$22(P) X9.P$23(P) X9.P$24(P) X9.P$25(P) X9.P$26(P) X9.P$27(P) X9.P$28(P) X9.P$29(P) X9.P$30(P) X9.P$31(P) X9.P$32(P) X9.P$33(P) X9.P$34(P) X9.P$35(P) X9.P$36(P) X9.P$37(P) X9.P$38(P) X9.P$39(P) X9.P$40(P) X9.P$41(P) X9.P$42(P) X9.P$43(P) X9.P$44(P) X9.P$45(P) X9.P$46(P) X9.P$47(P) X9.P$48(P) X9.P$49(P) X9.P$50(P) X9.P$51(P) X9.P$52(P) X9.P$53(P) X9.P$54(P) X9.P$55(P) X9.P$56(P) X9.P$57(P) X9.P$58(P) X9.P$59(P) X9.P$60(P) X9.P$61(P) X9.P$62(P) X9.P$63(P) X9.P$64(P) X9.P$65(P) X9.P$66(P) X9.P$67(P)
V3: R17.1 R129.1 TP26.P$1(TP) X8.P$1(P) X8.P$2(P) X8.P$3(P) X8.P$4(P) X8.P$5(P) X8.P$6(P) X8.P$7(P) X8.P$8(P) X8.P$9(P) X8.P$10(P) X8.P$11(P) X8.P$12(P) X8.P$13(P) X8.P$14(P) X8.P$15(P) X8.P$16(P) X8.P$17(P) X8.P$18(P) X8.P$19(P) X8.P$20(P) X8.P$21(P) X8.P$22(P) X8.P$23(P) X8.P$24(P) X8.P$25(P) X8.P$26(P) X8.P$27(P) X8.P$28(P) X8.P$29(P) X8.P$30(P) X8.P$31(P) X8.P$32(P) X8.P$33(P) X8.P$34(P) X8.P$35(P) X8.P$36(P) X8.P$37(P) X8.P$38(P) X8.P$39(P) X8.P$40(P) X8.P$41(P) X8.P$42(P) X8.P$43(P) X8.P$44(P) X8.P$45(P) X8.P$46(P) X8.P$47(P) X8.P$48(P) X8.P$49(P) X8.P$50(P) X8.P$51(P) X8.P$52(P) X8.P$53(P) X8.P$54(P) X8.P$55(P) X8.P$56(P) X8.P$57(P) X8.P$58(P) X8.P$59(P) X8.P$60(P) X8.P$61(P) X8.P$62(P) X8.P$63(P) X8.P$64(P) X8.P$65(P) X8.P$66(P) X8.P$67(P)
V_PACK: C61.1 D4.C D6.A D8.A R79.2 R218.2 R227.2 T14.1(S) T14.2(S) T14.3(S) TP43.P$1(TP) X13.5 X13.6 X13.7
VBAT_FUSED: C41.2 D19.A F2.T3(F2) R43.2 T13.1(S) T13.2(S) T13.3(S)
VSS_BAT: C7.2 C46.2 C49.2 C56.2 C59.2 C60.2 C168.2 C169.2 C171.2 C177.2 IC1.6(VSS) IC1.P$1(VSS) IC1.P$2(VSS) IC26.17(-PWR:VSS) R48.1 R50.1 R138.1 R190.1 R192.1 T11.2(S) T12.2(S) TP29.P$1(TP) X11.P$1(P) X11.P$2(P) X11.P$3(P) X11.P$4(P) X11.P$5(P) X11.P$6(P) X11.P$7(P) X11.P$8(P) X11.P$9(P) X11.P$10(P) X11.P$11(P) X11.P$12(P) X11.P$13(P) X11.P$14(P) X11.P$15(P) X11.P$16(P) X11.P$17(P) X11.P$18(P) X11.P$19(P) X11.P$20(P) X11.P$21(P) X11.P$22(P) X11.P$23(P) X11.P$24(P) X11.P$25(P) X11.P$26(P) X11.P$27(P) X11.P$28(P) X11.P$29(P) X11.P$30(P) X11.P$31(P) X11.P$32(P) X11.P$33(P) X11.P$34(P) X11.P$35(P) X11.P$36(P) X11.P$37(P) X11.P$38(P) X11.P$39(P) X11.P$40(P) X11.P$41(P) X11.P$42(P) X11.P$43(P) X11.P$44(P) X11.P$45(P) X11.P$46(P) X11.P$47(P) X11.P$48(P) X11.P$49(P) X11.P$50(P) X11.P$51(P) X11.P$52(P) X11.P$53(P) X11.P$54(P) X11.P$55(P) X11.P$56(P) X11.P$57(P) X11.P$58(P) X11.P$59(P) X11.P$60(P) X11.P$61(P) X11.P$62(P) X11.P$63(P) X11.P$64(P) X11.P$65(P) X11.P$66(P) X11.P$67(P) X14.2
Unconnected: D11.1(A1) D20.2(C_RED) D20.4(C_BLUE) IC4.3(ALERT) IC5.3(ALERT) IC8.11(-PORTA:PA3) IC8.16(-PORTC:PC4) IC8.19(-PORTB:PB2) IC8.40(-PORTC:PC11) IC10.4(EN) IC11.9(PMON) IC11.14(CMPOUT) IC11.18(BATDRV) IC14.6(I/O4) IC26.23(-IO:TS3) IC26.31(-IO:DCHG) IC26.32(-IO:DDSG) IC26.34(-PWR:REG2) IC26.35(-PWR:REG1) IC26.39(-IO:PDSG) IC26.40(-IO:PCHG) X1.A2(SSTXP1) X1.A3(SSTXN1) X1.A6(DP1) X1.A7(DN1) X1.A8(SBU1) X1.A10(SSRXN2) X1.A11(SSRXP2) X1.B2(SSTXP2) X1.B3(SSTXN2) X1.B6(DP2) X1.B7(DN2) X1.B8(SBU2) X1.B10(SSRXN1) X1.B11(SSRXP1)

## Notes on the sheet
- Changelog 3/3
- Changelog:
  6.3
  - R147, R148: n.m. -> 0R
  - R228: n.m. -> 330R
  - Project number 28010I replaced by Aligni number 63-00013
  - Hardware version resistors changed:
  -- R124: 0R -> 10M
  -- R125: n.m. -> 10M
  - C16: n.m. -> 100n 50V
  - 32.7 kHz crystal added to STM32
  - C7 and X14,Pin 2 connected to VSS_BAT instead of GND
  - T2, T7: PMV30ENEA -> DMG1012UW-7 because lower gate threshold voltage is required
  - R13, R14 added (pull-down resistors at UC_USB_CC1/2)
  - Position of R46 changed in layout for reducing the risk of short to C4+ connection
  - STM32 pinout changes:
  -- UC_DSG_FET_DISABLE moved from PC14 to PA8
  -- UC_CHG_FET_DISABLE moved from PC15 to PB13
  -- 32.7 kHz crystal connected to OSC32_IN (PC14) and OSC32_OUT (PC15)
- Battery Monitor 1/2 | Battery Monitor 2/2
- Changelog 2/3
- Changelog:
  4.1
  - X1 replaced by USB Type C receptacle
  - T6, T7 replaced by NPN transistor
  - R34, R88: 10M -> 1M
  - R46, R89: 4M7 -> 470k
  4.2
  - Testpoints added
  - Pads for connection of temperature sensor added
  5.0
  - STM32L071 replaced by STM32G071
  - USB PD controller TPS65987DDHRSHR, Flash and Debug-Connector removed
  - IADP and IDCHG of BQ24780 connected to STM32
  - R217: 0R -> 10k
  - RST_SHUT of BQ76952 connected to STM32
  - User button added
  - Second NTC connection added
  - Red/green status LED replaced by 3 white LEDs
  6.0
  - IC26: device "BQ76952" replaced by "BQ769X2"
  - IC26: X8 connected to pin 2 instead of pin 1 for compatibility with BQ76942
  - IC8: STM32G071GBU6N -> STM32G431CBU6 because it has a CAN periphery 
    and we already use the G4 series on the Mainboard
  - 24 MHz crystal added to STM32
  - Programming connector FTSH-105-01-F-DV-K replaced by Tag-Connect pads
  - Button S1 type changed: 431151015826 -> 430451025836
  - LED D4 type changed: 150066SV74000 -> 150060GS75000
  - R56: 10k -> 110k
  - LEDs D2 and D9 removed and replaced by testpoints
  - 100n capacitor added to UC_USER_BTN and R12 increased to 10k for debouncing
  - X2: 5146800-1 replaced by SSW-110-03-G-S-RA-LL
  - White LEDs D12, D13, D14 (MP-2016-1100-65-80) replaced by single RGB LED 150120M173000
  - 2x SPACER 702916000 added
  - Mounting hole diameters reduced from 3.3 mm to 2.3 mm
  - 10 A fuse 0680L9100 added
  - 12 A SCP fuse SFJ-1412 added
  - BAT_SRN renamed to V_PACK
  - Output of charger (BQ24780) connected to COMMON_DRAIN instead of V_PACK/BAT_SRN
  - P-Ch MOSFETs TPH1R712MD replaced by N-Ch MOSFETs SiSS06DN and connected to BQ769X2
  - T1 & T3 (CSD17577Q3A) replaced by SISS06DN because of lower R_DS(on)
  - Under- and overvoltage protection removed
  - Connection from VBAT_FUSED to +3V3-LDO added and value of D6 changed to "n.m."
  - NSR0240HT1G replaced by PMEG6010CEJ
  - R39, C16, D11 removed
  - All 0402 resistors and capacitors replaced by 0603 devices
  - D4: 150060GS75000 -> 150044M155260
  - C14 (47 nF) replaced by 2 x 100 nF in series
  - C39: 47 nF -> 100 nF
  - C15, C234, C235, C282, C283: 220 pF -> 100 pF
  - C40: 1 nF -> 100 pF
  - C173: 470 nF -> 1 uF
  - C43, C52, C177: 2u2 -> 22u
  - C171: 2u2 (1206) -> 4u7 (1210)
  - R189, R190, R191: 100R -> 150R
  - R176, R177, R181, R184, R188: 20R (1206) -> 3 x 10R (0603)
  - All 27R resistors changed to 10R
  - R23: 4R7 -> 10R
  - R1, R26, R31, R40, R42, R56: 110k -> 100k
  - R99: 47k -> 100k
  - R28: 240k -> 510k
  - R24: 680k -> 510k + 100k
  6.1
  - TMP112NAIDRL added as a replacement for TMP1075DGK; value of IC4 changed to n.m.
  - New hardware version: R125: 0R -> n.m.; R124: n.m. -> 0R
  - R217 an R227 connected to V_PACK instead of +VBAT
  - R55 decreased from 10M down to 510k because it was not strong enough to pull it up to a valid high level
  - Cell connection pads closed at the edge of the PCB (milling removed and dimension line changed)
  - SMBus and Single-Wire-UART interface removed; R90 changed from n.m. to 0R; 
    TP42 added to C64 (previously UC_SMBUS_SCL_3V3)
  - !UC_LED_R connected to PA7 instead of PC4
  - !UC_LED_B connected to PB1 instead of PB13
  - Debug UART testpoints TP30 and TP31 connected to PB10 and PB11 instead of PA2 and PA3
  - New signal UC_USB_DET_3V3 connected to PA2 (T2, T7, R3, R8 added)
  - R228 placed on top side for better access during development
  - R147 and R148 changed from 0R to n.m. (will be populated after connecting the battery cells)
  - Worldcoin logo inserted
  - Position of testpoints TP30 and TP35 changed to reduce risk of short to SCP_HEATER
  - SPACER1, SPACER2 and X13 set to not mounted
  6.2
  - Testpoint TP43 added to V_PACK
- f_CLK = 0 ... 400 kHz
  address: 0001000b
- Changelog 1/3
- Changelog:
  1.0
  - initial release
  1.1
  - SPI-Flash added (IC3)
  - Debug connector X3 added
  - L1 replaced by WE-XHMI 74439358022
    for f_S = 0.8 MHz instead of 1.2 MHz
    in order to increase efficiency
  - R52: 110k -> 137k
  - Update footprint of TPS65987D
  - R56: 110k -> 10k
  - R54, R55: 10k -> 1k8
  - Redcubes X3, X5 added for mechanical mounting
  - R1: 12k7 -> 10k
  - R2: 10k -> 110k
  2.0
  - T2, T4, T5, C37, R57, R27, R29, R34, R43, R46, R47 removed
  - R42: 220k -> 110k
  - T2, R27 added
  - R51: 330k -> 110k
  - R50: 110k -> 330k
  - Ferrit L16 added
  - Battery monitor BQ76952 added
  - STM32F302RBT6 replaced by STM32L071KZU6
  - X4: 61200821621 -> 62200821121
  - IC3: MX25L8006EM1I-12G -> MX25L8006EZUI-12G (USON)
  - X1: 632723300011 -> DX07S024WJ1
  - Temperatur sensor TMP1075 added
  - L1: 74439358022 -> 744771002
  - Battery undervoltage and overvoltage protection added
  - EMC filters added to TYPE_C_CC1/2 and TYPE_C_D_N/P
  - R3, R4, R5, R10, R22, R23, R24, R40 removed
  - R9: n.m. -> 0R
  3.0
  - BQ25713 replaced by BQ24780S
  - Battery monitor removed
  - Battery over-/undervoltage protection removed
  - R93, R94 increased from 1k8 to 10k for SMBus specification
  4.0
  - Battery monitor added
  - Battery over-/undervoltage protection added
  - Single wire UART interface added
  - R7, R37: 10 mR -> 5 mR for reduction of power losses
  - L16: 74279252 -> 742792410 for reduced power losses
  - Fuse F1 removed
  - H4 removed
  - Testpoints TP1...5 added
  - USB Type C connector X1 replaced by 5 pin socket header
  - R9 removed
  - Comparator in UVLO circuit replaced
- (5mR)
- Second overvoltage protection
- Delay time can be reduced
  for device testing by pulling
  CD to GND.
- STM32 1/2 | STM32 2/2 | User Indicator LEDs
- wkup
- wkup
- Pull BOOT0 (PB8) on low-level during startup
- 40 kR pull-up on PB4 enabled after reset
- STM32 SWD programming interface
- 150044M155260:
  V_F,R,typ,5mA = 2.0 V
  V_F,G,typ,5mA = 2.7 V
  V_F,B,typ,5mA = 2.8 V
- 40 kR pull-up on PA13 & PA15 enabled after reset
  40 kR pull-down on PA14 enabled after reset
- X6 on bottom-layer
  X21 on top-layer
- UCPD1_DBCCx (PA9/PA10) must be bridged
  to the corresponding UCPD1_CCx (PB6/PB4)
  for supporting dead battery functionality
- +3V3 supply
- 3.267 V / 3.300 V / 3.333 V
   (min. / typ.  / max.)
- internal pull-up @ EN-pin
- wkup
- USB Type C Connector | Battery Charger | Battery safety switch
- Additional conventional fuse F1 because
  the Self Control Protector fuse F2 has a 
  low interrupting rating of only 50 A
- (10 A, slow-blow, 
  500 A interrupting rating)
- (5mR)
- Two 0R resistors for redundancy
  Can be removed for testing
- 7 x 4u7 25V
- f_SW = 600 kHz
- Connector to load
- max. 6.5 V
- 2.4 V -> ACOK
- Misc
- (5mR)
- (4.7uH)
- Can be used
  to identify
  different hardware
  versions
- 7 x 4u7 25V
- f_g = 160 Hz
- charge current
  limit = 5.4 A
- hardware versions:
  6.0: R125 = 0R; R124 = n.m.
  6.1 / 6.2: R125 = n.m.; R124 = 0R
  6.3: R125 = 10M; R124 = 10M
- Temperature Sensors | f_CLK = 1 ... 2560 kHz
- address: 1001111b
- f_CLK = 10 ... 100 kHz
- address: 0010010b
- 10k @ 25 °C
  4M7 @ 100 °C
- Place close to MOSFETs T13/T14
- f_CLK = 1 ... 2850 kHz
- address: 1001000b